# EAGLE design OBC_v4.22 (EAGLE 9.6.2)

## Sheet 1 of 3
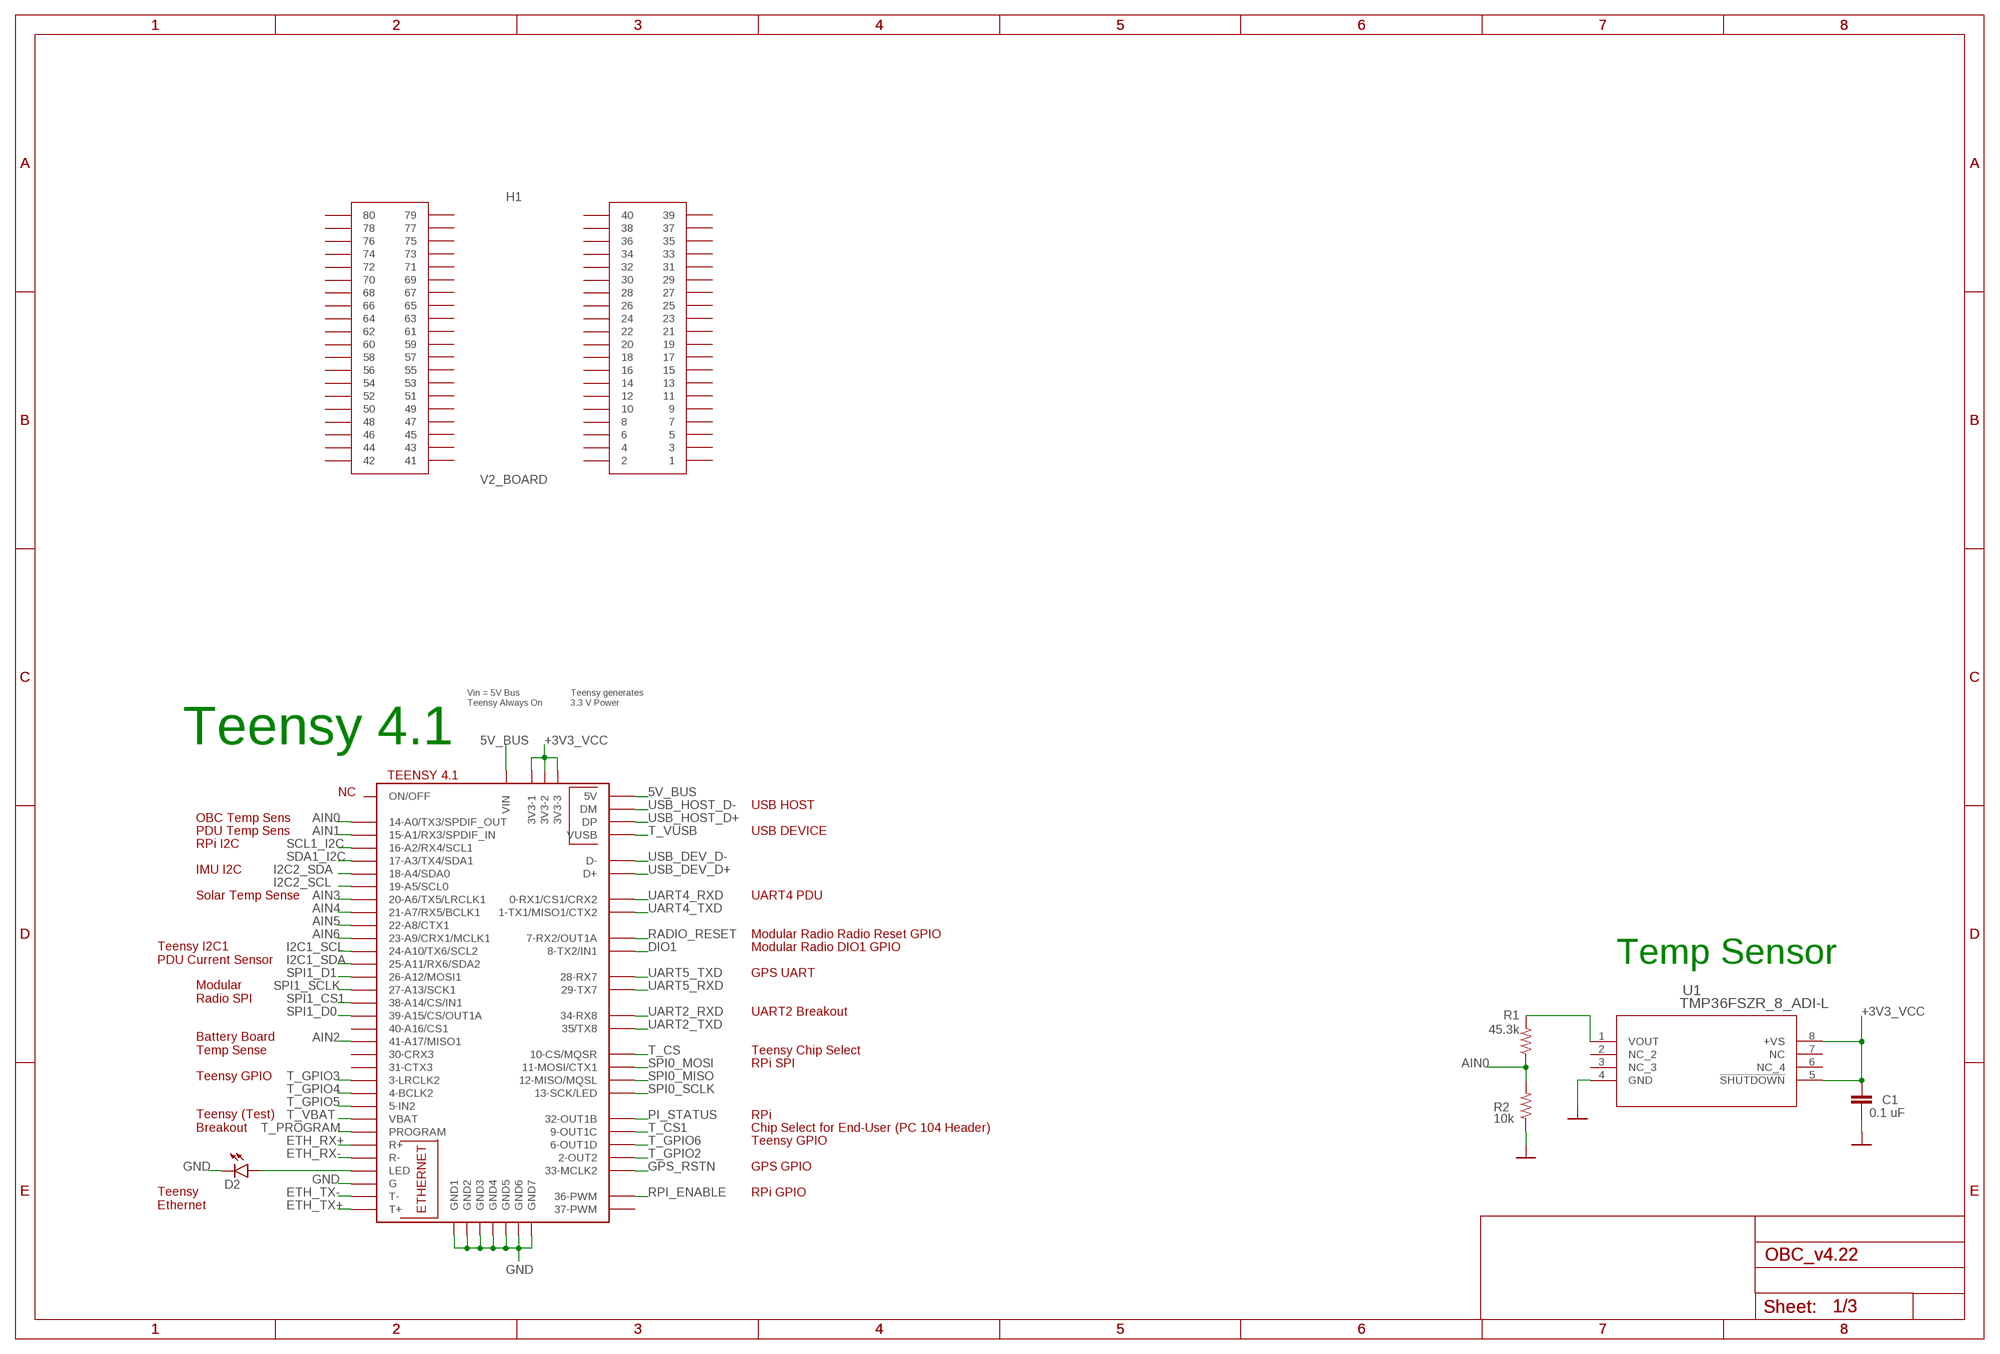
[diagram p0: schematic, sheet 1]

### Parts
C1  0.1 uF  CAP0805  [0805]
D2  LEDCHIP-LED0603  [CHIP-LED0603]
H1  V2_BOARD  [BOARD_TEMPLATE]
R1  45.3k  RESISTOR0805-RES  [0805]
R2  10k  RESISTOR0805-RES  [0805]
U1  TMP36FSZR_8_ADI-L  [R_8_ADI-L]
U$1  TEENSY41TEENSY  [TEENSY41]

### Nets
5V_BUS: U$1.+5V(5V) U$1.VIN ; also sheet 2
+3V3_VCC: C1.1 U1.5(!SHUTDOWN) U1.8(+VS) U$1.3V3-1 U$1.3V3-2 U$1.3V3-3 ; also sheet 3
AIN0: R1.1 R2.2 U$1.14-A0/TX3/SPDIF_OUT
AIN1: U$1.15-A1/RX3/SPDIF_IN
AIN2: U$1.41-A17/MISO1
AIN3: U$1.20-A6/TX5/LRCLK1
AIN4: U$1.21-A7/RX5/BCLK1
AIN5: U$1.22-A8/CTX1
AIN6: U$1.23-A9/CRX1/MCLK1
DIO1: U$1.8-TX2/IN1 ; also sheet 3
ETH_RX+: U$1.R+
ETH_RX-: U$1.R-
ETH_TX+: U$1.T+
ETH_TX-: U$1.T-
GND: C1.2 D2.C R2.1 U1.4(GND) U$1.G U$1.GND1 U$1.GND2 U$1.GND3 U$1.GND4 U$1.GND5 U$1.GND6 U$1.GND(GND7) ; also sheet 2,3
GPS_RSTN: U$1.33-MCLK2 ; also sheet 3
I2C1_SCL: U$1.24-A10/TX6/SCL2
I2C1_SDA: U$1.25-A11/RX6/SDA2
I2C2_SCL: U$1.19-A5/SCL0 ; also sheet 3
I2C2_SDA: U$1.18-A4/SDA0 ; also sheet 3
N$8: D2.A U$1.LED
N$15: R1.2 U1.1(VOUT)
PI_STATUS: U$1.32-OUT1B ; also sheet 2
RADIO_RESET: U$1.7-RX2/OUT1A ; also sheet 3
RPI_ENABLE: U$1.36-PWM ; also sheet 2
SCL1_I2C: U$1.16-A2/RX4/SCL1 ; also sheet 2
SDA1_I2C: U$1.17-A3/TX4/SDA1 ; also sheet 2
SPI0_MISO: U$1.12-MISO/MQSL ; also sheet 2
SPI0_MOSI: U$1.11-MOSI/CTX1 ; also sheet 2
SPI0_SCLK: U$1.13-SCK/LED ; also sheet 2
SPI1_CS1: U$1.38-A14/CS/IN1 ; also sheet 3
SPI1_D0: U$1.39-A15/CS/OUT1A ; also sheet 3
SPI1_D1: U$1.26-A12/MOSI1 ; also sheet 3
SPI1_SCLK: U$1.27-A13/SCK1 ; also sheet 3
T_CS: U$1.10-CS\MQSR(10-CS/MQSR)
T_CS1: U$1.9-OUT1C
T_GPIO2: U$1.2-OUT2
T_GPIO3: U$1.3-LRCLK2
T_GPIO4: U$1.4-BCLK2
T_GPIO5: U$1.5-IN2
T_GPIO6: U$1.6-OUT1D
T_PROGRAM: U$1.PROGRAM
T_VBAT: U$1.VBAT
T_VUSB: U$1.VUSB
UART2_RXD: U$1.34-RX8
UART2_TXD: U$1.35-TX8(35/TX8)
UART4_RXD: U$1.0-RX1/CS1/CRX2
UART4_TXD: U$1.1-TX1/MISO1/CTX2
UART5_RXD: U$1.29-TX7 ; also sheet 3
UART5_TXD: U$1.28-RX7 ; also sheet 3
USB_DEV_D+: U$1.D+
USB_DEV_D-: U$1.D-
USB_HOST_D+: U$1.DP
USB_HOST_D-: U$1.DM
Unconnected: H1.1 H1.2 H1.3 H1.4 H1.5 H1.6 H1.7 H1.8 H1.9 H1.10 H1.11 H1.12 H1.13 H1.14 H1.15 H1.16 H1.17 H1.18 H1.19 H1.20 H1.21 H1.22 H1.23 H1.24 H1.25 H1.26 H1.27 H1.28 H1.29 H1.30 H1.31 H1.32 H1.33 H1.34 H1.35 H1.36 H1.37 H1.38 H1.39 H1.40 H1.41 H1.42 H1.43 H1.44 H1.45 H1.46 H1.47 H1.48 H1.49 H1.50 H1.51 H1.52 H1.53 H1.54 H1.55 H1.56 H1.57 H1.58 H1.59 H1.60 H1.61 H1.62 H1.63 H1.64 H1.65 H1.66 H1.67 H1.68 H1.69 H1.70 H1.71 H1.72 H1.73 H1.74 H1.75 H1.76 H1.77 H1.78 H1.79 H1.80 U1.2(NC_2) U1.3(NC_3) U1.6(NC_4) U1.7(NC) U$1.30-CRX3 U$1.31-CTX3 U$1.37-PWM U$1.40-A16/CS1 U$1.ON/OFF

### Notes on the sheet
- Vin = 5V Bus 
  Teensy Always On
- Teensy generates 
  3.3 V Power
- Teensy 4.1
- NC
- USB HOST
- OBC Temp Sens
- PDU Temp Sens | USB DEVICE
- RPi I2C
- IMU I2C
- Solar Temp Sense | UART4 PDU
- Modular Radio Radio Reset GPIO
- Modular Radio DIO1 GPIO
- Teensy I2C1
  PDU Current Sensor
- Temp Sensor
- GPS UART
- Modular 
  Radio SPI
- UART2 Breakout
- Battery Board
  Temp Sense
- Teensy Chip Select
- RPi SPI
- Teensy GPIO
- RPi
- Teensy (Test)
  Breakout
- Chip Select for End-User (PC 104 Header)
- Teensy GPIO
- GPS GPIO
- RPi GPIO
- Teensy 
  Ethernet

## Sheet 2 of 3
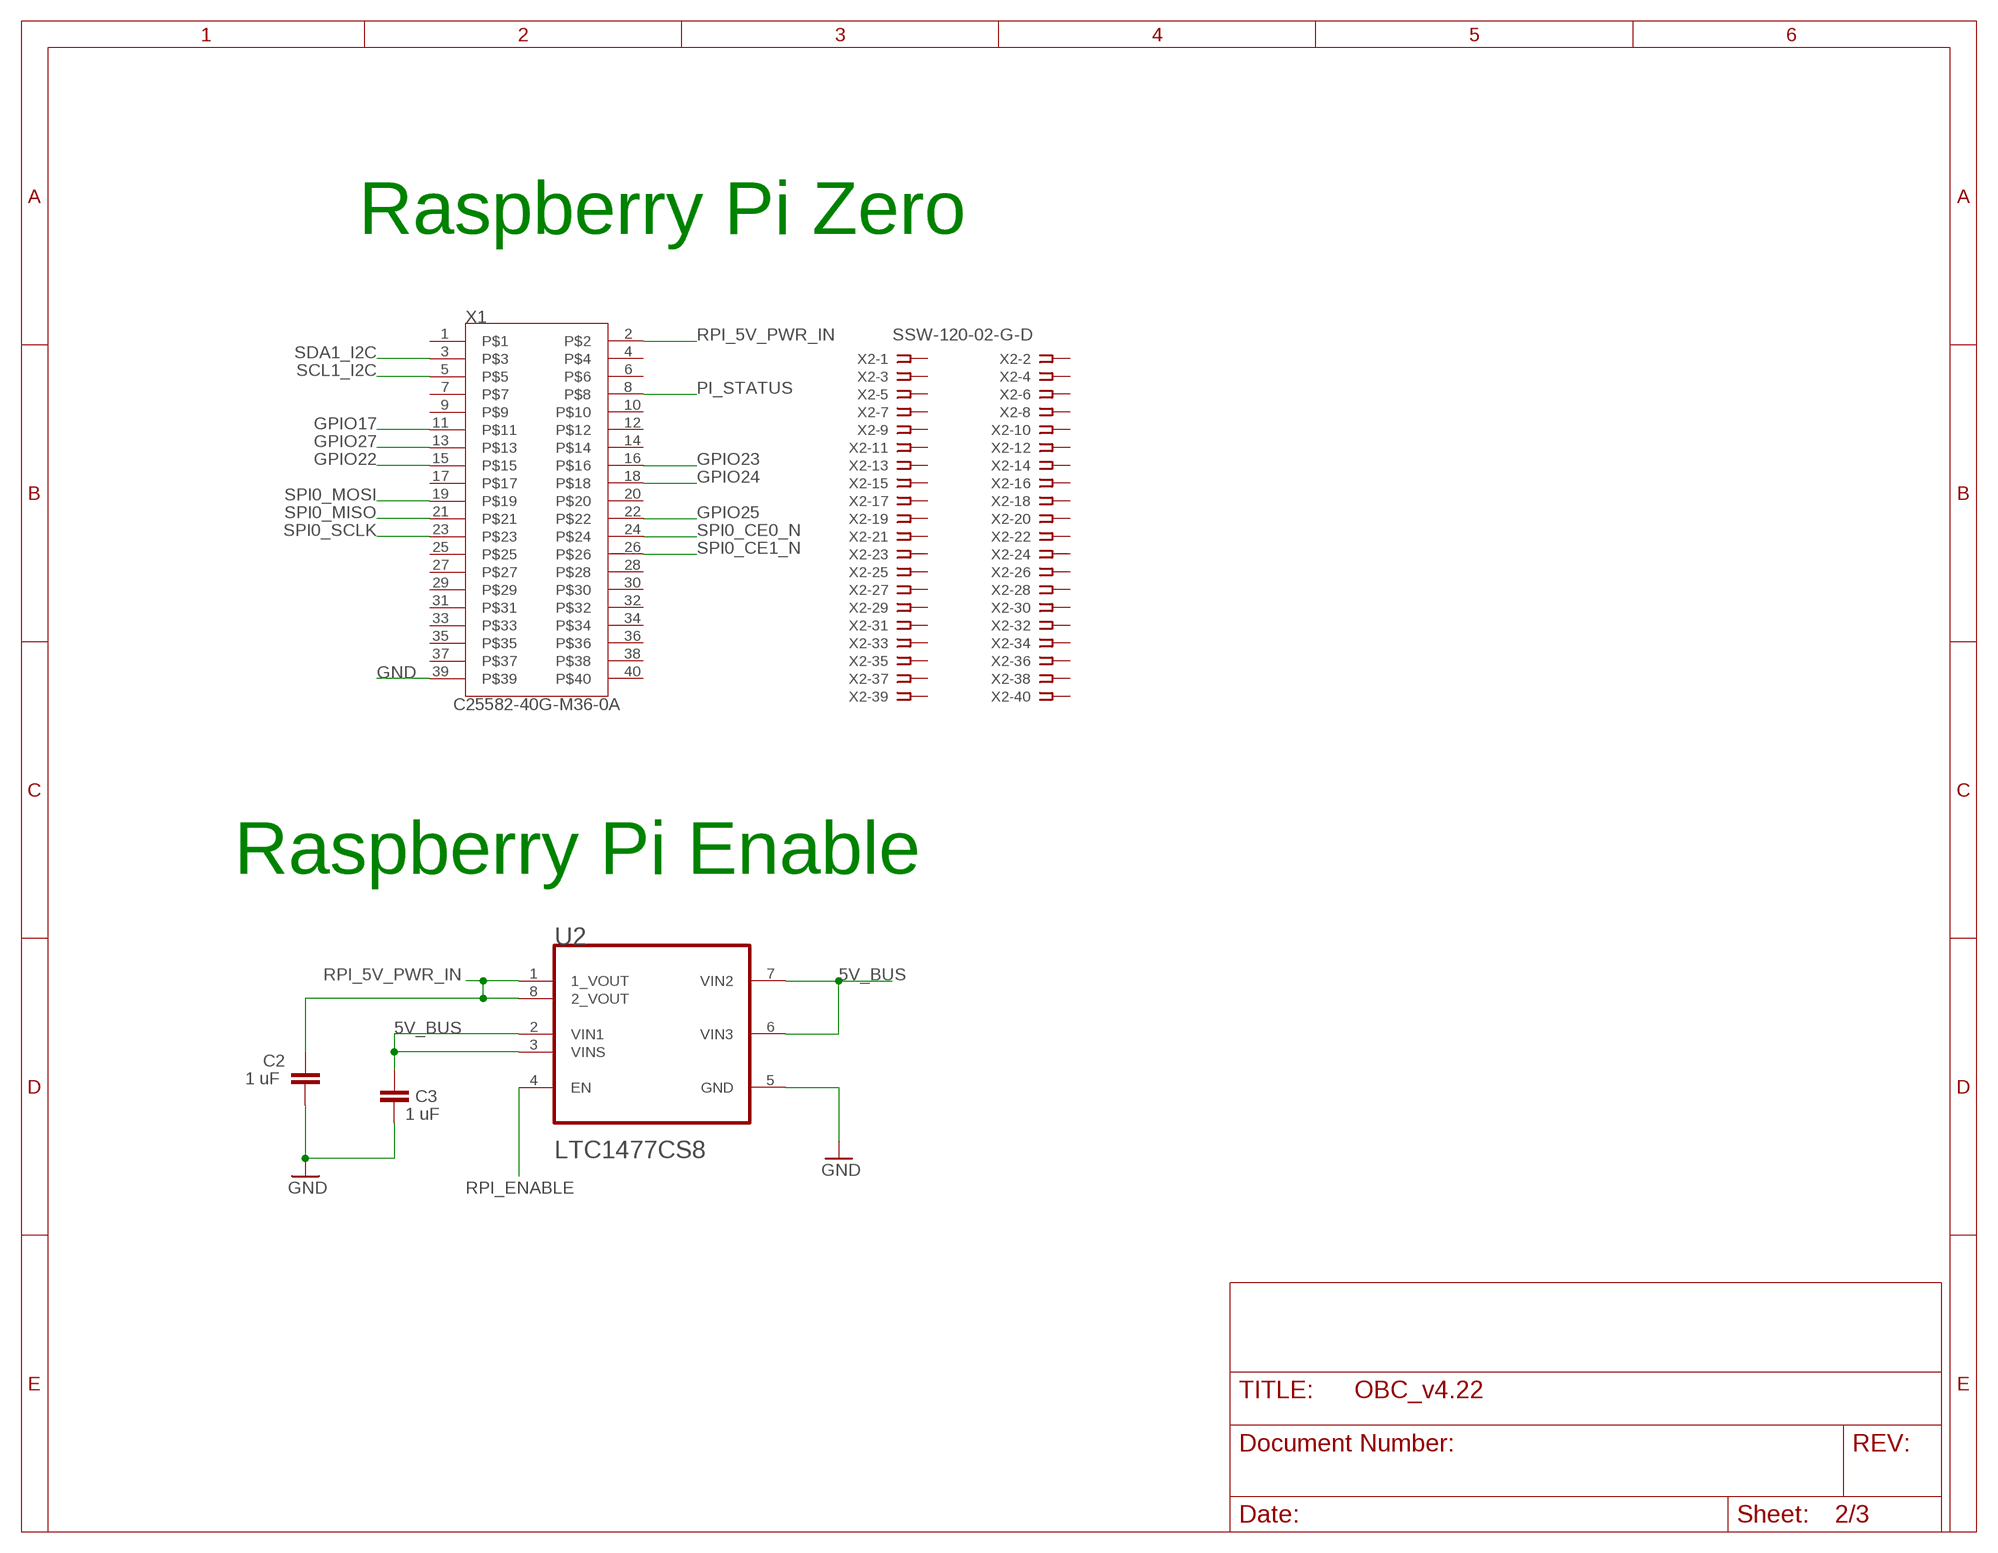
[diagram p1: schematic, sheet 2]

### Parts
C2  1 uF  CAP0805  [0805]
C3  1 uF  CAP0805  [0805]
U2  LTC1477CS8LINEAR_TECHNOLOGY_LTC1477CS8_0_2  [LINEAR_TECHNOLOGY_LTC1477CS8_2]
X1  C25582-40G-M36-0A  [ADAFRUIT_C25582-40G-M36-0A_0]
X2  SSW-120-02-G-D  [SSW-120-02-G-D]

### Nets
5V_BUS: C3.1 U2.2(VIN1) U2.3(VINS) U2.6(VIN3) U2.7(VIN2) ; also sheet 1
GND: C2.2 C3.2 U2.5(GND) X1.39 ; also sheet 1,3
GPIO17: X1.11
GPIO22: X1.15
GPIO23: X1.16
GPIO24: X1.18
GPIO25: X1.22
GPIO27: X1.13
PI_STATUS: X1.8 ; also sheet 1
RPI_5V_PWR_IN: C2.1 U2.1(1_VOUT) U2.8(2_VOUT) X1.2
RPI_ENABLE: U2.4(EN) ; also sheet 1
SCL1_I2C: X1.5 ; also sheet 1
SDA1_I2C: X1.3 ; also sheet 1
SPI0_CE0_N: X1.24
SPI0_CE1_N: X1.26
SPI0_MISO: X1.21 ; also sheet 1
SPI0_MOSI: X1.19 ; also sheet 1
SPI0_SCLK: X1.23 ; also sheet 1
Unconnected: X1.1 X1.4 X1.6 X1.7 X1.9 X1.10 X1.12 X1.14 X1.17 X1.20 X1.25 X1.27 X1.28 X1.29 X1.30 X1.31 X1.32 X1.33 X1.34 X1.35 X1.36 X1.37 X1.38 X1.40 X2.1 X2.2 X2.3 X2.4 X2.5 X2.6 X2.7 X2.8 X2.9 X2.10 X2.11 X2.12 X2.13 X2.14 X2.15 X2.16 X2.17 X2.18 X2.19 X2.20 X2.21 X2.22 X2.23 X2.24 X2.25 X2.26 X2.27 X2.28 X2.29 X2.30 X2.31 X2.32 X2.33 X2.34 X2.35 X2.36 X2.37 X2.38 X2.39 X2.40

### Notes on the sheet
- Raspberry Pi Zero
- Raspberry Pi Enable

## Sheet 3 of 3
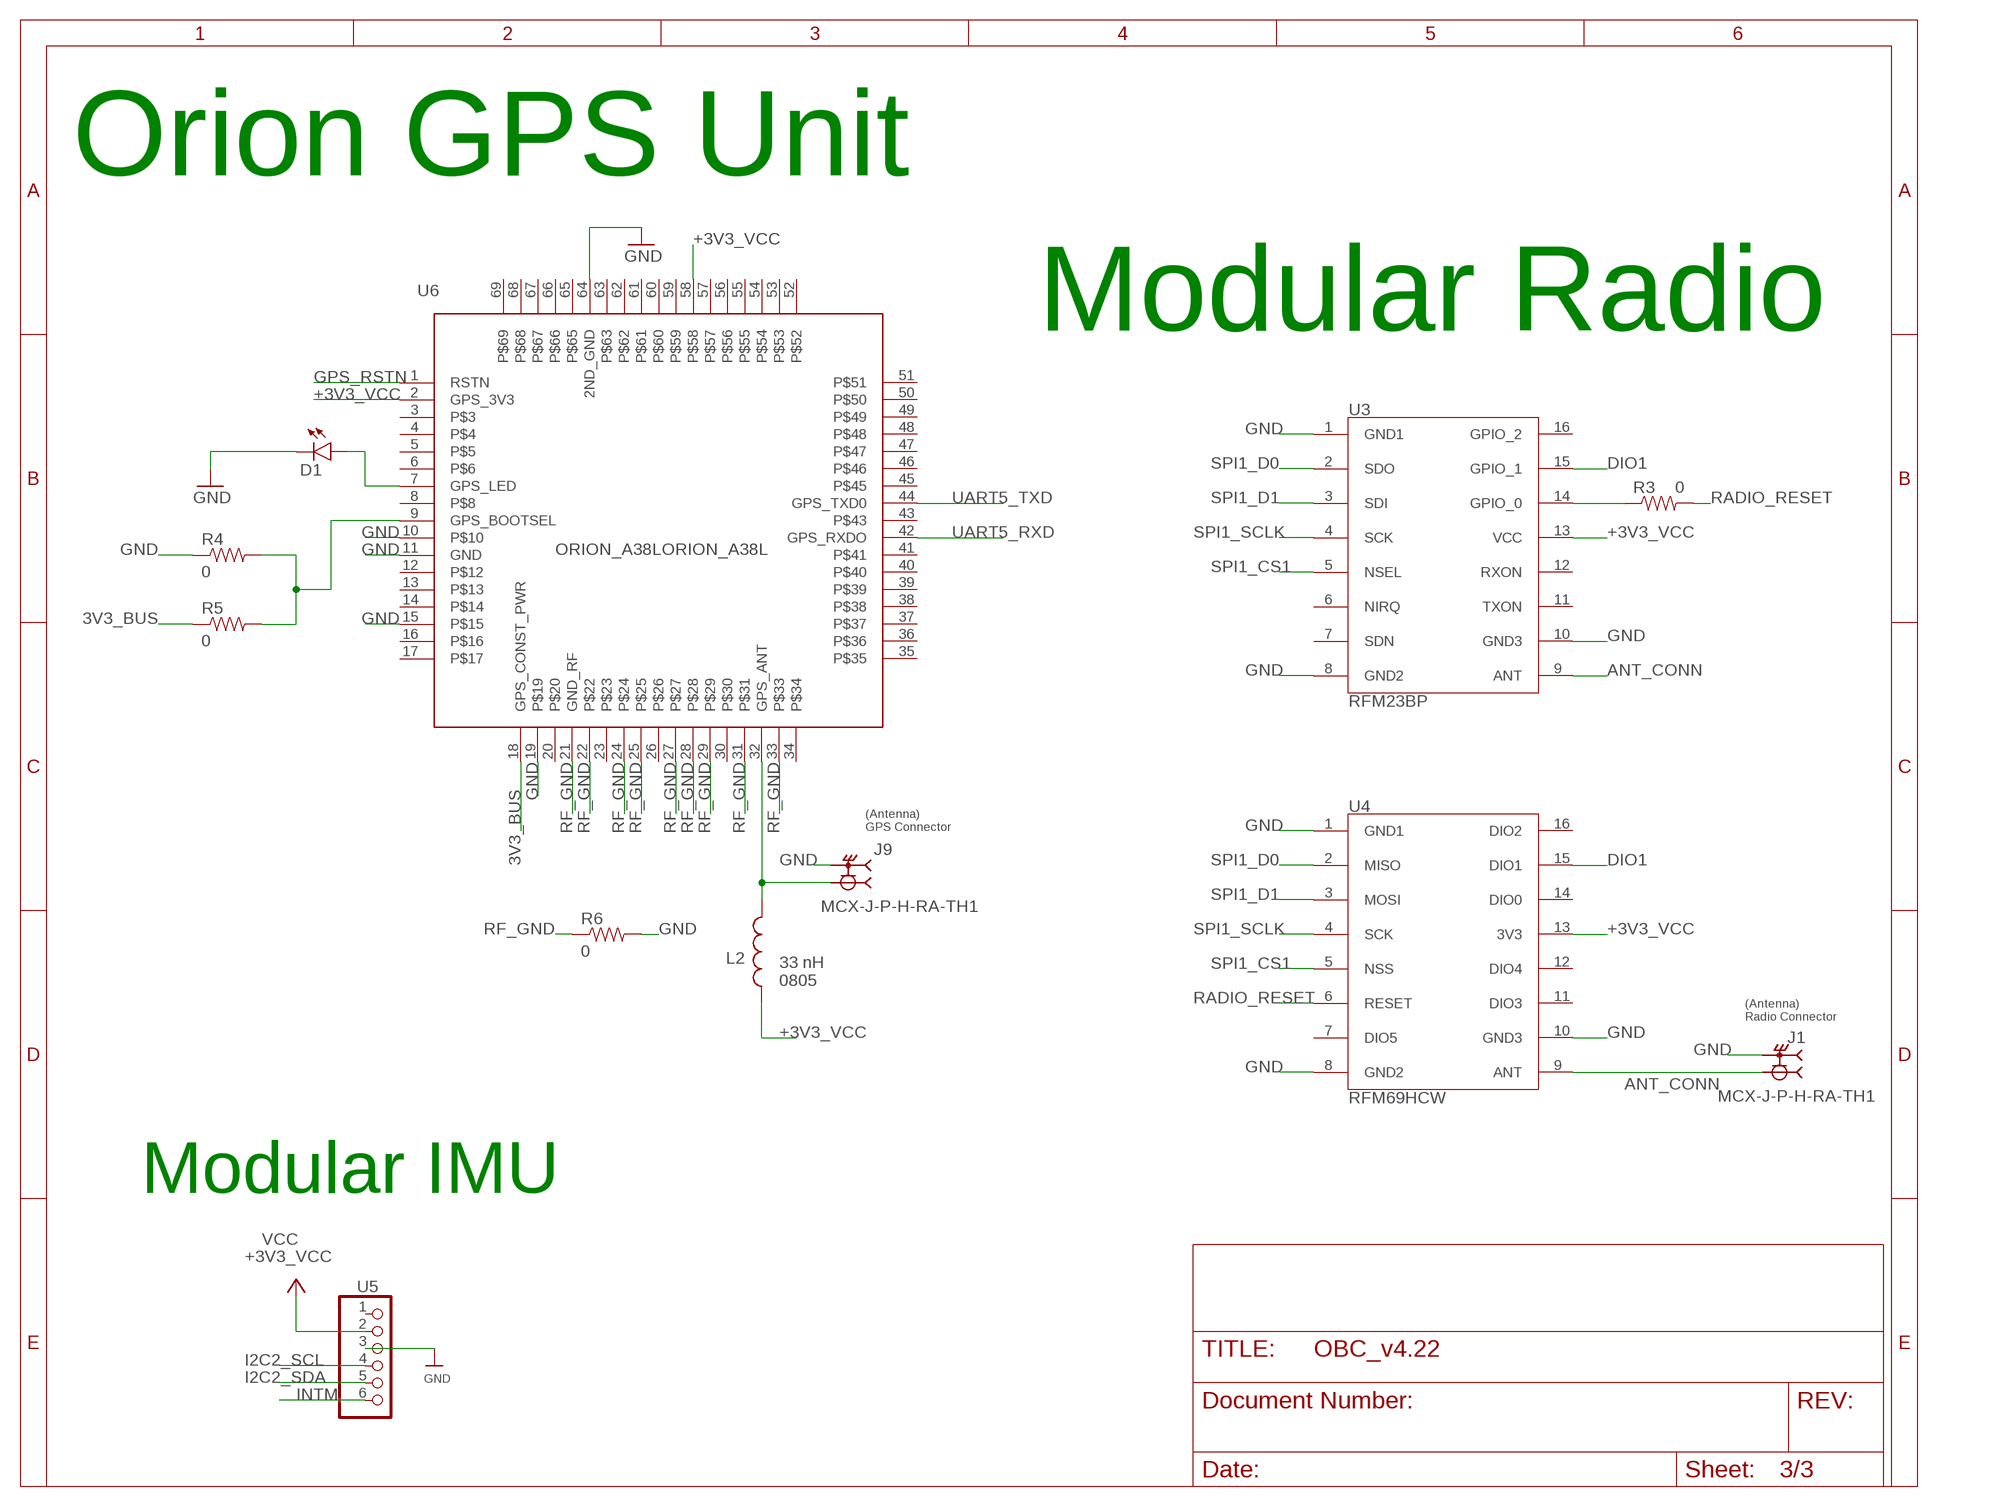
[diagram p2: schematic, sheet 3]

### Parts
D1  LEDCHIP-LED0603  [CHIP-LED0603]
J1  MCX-J-P-H-RA-TH1  [SAMTEC_MCX-J-P-H-RA-TH1]
J9  MCX-J-P-H-RA-TH1  [SAMTEC_MCX-J-P-H-RA-TH1]
L2  AIMC-0805-2N2S-T  [INDC2012X105N]
R3  0  RESISTOR0805-RES  [0805]
R4  0  RESISTOR0805-RES  [0805]
R5  0  RESISTOR0805-RES  [0805]
R6  0  RESISTOR0805-RES  [0805]
U3  RFM23BP  [RFM23BP]
U4  RFM69HCW  [RFM69HCW]
U5  HEADER-1X670MIL  [1X06_ROUND_70]
U6  ORION_A38LORION_A38L  [ORION_A38L]

### Nets
3V3_BUS: R5.1 U6.18(GPS_CONST_PWR)
+3V3_VCC: L2.1 U3.13(VCC) U4.13(3V3) U5.2 U6.2(GPS_3V3) U6.58 ; supply symbol labelled VCC ; also sheet 1
ANT_CONN: J1.1 U3.9(ANT) U4.9(ANT)
DIO1: U3.15(GPIO_1) U4.15(DIO1) ; also sheet 1
GND: D1.C J1.S1 J1.S2 J1.S3 J1.S4 J9.S1 J9.S2 J9.S3 J9.S4 R4.1 R6.2 U3.1(GND1) U3.8(GND2) U3.10(GND3) U4.1(GND1) U4.8(GND2) U4.10(GND3) U5.3 U6.10 U6.11(GND) U6.15 U6.19 U6.64(2ND_GND) ; also sheet 1,2
GPS_RSTN: U6.1(RSTN) ; also sheet 1
I2C2_SCL: U5.4 ; also sheet 1
I2C2_SDA: U5.5 ; also sheet 1
INTM: U5.6
N$9: R3.1 U3.14(GPIO_0)
N$16: R4.2 R5.2 U6.9(GPS_BOOTSEL)
N$17: J9.1 L2.2 U6.32(GPS_ANT)
N$21: D1.A U6.7(GPS_LED)
RADIO_RESET: R3.2 U4.6(RESET) ; also sheet 1
RF_GND: R6.1 U6.21(GND_RF) U6.22 U6.24 U6.25 U6.27 U6.28 U6.29 U6.31 U6.33
SPI1_CS1: U3.5(NSEL) U4.5(NSS) ; also sheet 1
SPI1_D0: U3.2(SDO) U4.2(MISO) ; also sheet 1
SPI1_D1: U3.3(SDI) U4.3(MOSI) ; also sheet 1
SPI1_SCLK: U3.4(SCK) U4.4(SCK) ; also sheet 1
UART5_RXD: U6.42(GPS_RXDO) ; also sheet 1
UART5_TXD: U6.44(GPS_TXD0) ; also sheet 1
Unconnected: U3.6(NIRQ) U3.7(SDN) U3.11(TXON) U3.12(RXON) U3.16(GPIO_2) U4.7(DIO5) U4.11(DIO3) U4.12(DIO4) U4.14(DIO0) U4.16(DIO2) U5.1 U6.3 U6.4 U6.5 U6.6 U6.8 U6.12 U6.13 U6.14 U6.16 U6.17 U6.20 U6.23 U6.26 U6.30 U6.34 U6.35 U6.36 U6.37 U6.38 U6.39 U6.40 U6.41 U6.43 U6.45 U6.46 U6.47 U6.48 U6.49 U6.50 U6.51 U6.52 U6.53 U6.54 U6.55 U6.56 U6.57 U6.59 U6.60 U6.61 U6.62 U6.63 U6.65 U6.66 U6.67 U6.68 U6.69

### Notes on the sheet
- Orion GPS Unit
- Modular Radio
- (Antenna)
  GPS Connector
- 33 nH
  0805
- (Antenna)
  Radio Connector
- Modular IMU

## Library data of the parts
C1-C3 = HSFL_Main_Library:CAP: Capacitor Standard 0603 ceramic capacitor, and 0.1" leaded capacitor.
D1 D2 = led:LED: LED OSRAM: - CHIPLED LG R971, LG N971, LY N971, LG Q971, LY Q971, LO R971, LY R971 LH N974, LH R974 LS Q976, LO Q976, LY Q976 LO Q996 - Hyper CHIPLED LW Q18S LB Q993, LB Q99A, LB R99A - SideLED LS A670, LO A670, LY A670, LG A670, LP A670 LB A673, LV A673, LT A673, LW A673 LH A674 LY A675 LS A676, LA A676, LO A676, LY A676, LW A676 LS A679, LY A679, LG A679 - Hyper Micro SIDELED® LS Y876, LA Y876, LO Y876, LY Y876 LT Y87S - SmartLED LW L88C, LW L88S LB L89C, LB L89S, LG L890 LS L89K, LO L89K, LY L89K LS L896, LA L896, LO L896, LY L896 - TOPLED LS T670, LO T670, LY T670, LG T670, LP T670 LSG T670, LSP T670, LSY T670, LOP T670, LYG T670 LG T671, LOG T671, LSG T671 LB T673, LV T673, LT T673, LW T673 LH T674 LS T676, LA T676, LO T676, LY T676, LB T676, LH T676, LSB T676, LW T676 LB T67C, LV T67C, LT T67C, LS T67K, LO T67K, LY T67K, LW E67C LS E67B, LA E67B, LO E67B, LY E67B, LB E67C, LV E67C, LT E67C LW T67C LS T679, LY T679, LG T679 LS T770, LO T770, LY T770, LG T770, LP T770 LB T773, LV T773, LT T773, LW T773 LH T774 LS E675, LA E675, LY E675, LS T675 LS T776, LA T776, LO T776, LY T776, LB T776 LHGB T686 LT T68C, LB T68C - Hyper Mini TOPLED® LB M676 - Mini TOPLED Santana® LG M470 LS M47K, LO M47K, LY M47K Source: http://www.osram.convergy.de LUXEON: - LUMILED® LXK2-PW12-R00, LXK2-PW12-S00, LXK2-PW14-U00, LXK2-PW14-V00 LXK2-PM12-R00, LXK2-PM12-S00, LXK2-PM14-U00 LXK2-PE12-Q00, LXK2-PE12-R00, LXK2-PE12-S00, LXK2-PE14-T00, LXK2-PE14-U00 LXK2-PB12-K00, LXK2-PB12-L00, LXK2-PB12-M00, LXK2-PB14-N00, LXK2-PB14-P00, LXK2-PB14-Q00 LXK2-PR12-L00, LXK2-PR12-M00, LXK2-PR14-Q00, LXK2-PR14-R00 LXK2-PD12-Q00, LXK2-PD12-R00, LXK2-PD12-S00 LXK2-PH12-R00, LXK2-PH12-S00 LXK2-PL12-P00, LXK2-PL12-Q00, LXK2-PL12-R00 Source: www.luxeon.com KINGBRIGHT: KA-3528ASYC Source: www.kingbright.com
H1 = Artemis v2 board:V2_BOARD
J1 J9 = OBCv4:MCX-J-P-H-RA-TH1: 50 Ohm MCX Jack or Plug, Through-hole; DESCRIPTION: MCX Connector Jack, Female Socket 50Ohm Through Hole, Right Angle Solder; DIGI-KEY_PART_NUMBER: SAM10607-ND; MF: Samtec; MP: MCX-J-P-H-RA-TH1; PACKAGE: None; PURCHASE-URL: https://pricing.snapeda.com/search/part/MCX-J-P-H-RA-TH1/?ref=eda
L2 = PDU:AIMC-0805-2N2S-T: 2.2nH Unshielded Multilayer Inductor 600mA 100mOhm Max 0805 (2012 Metric); DESCRIPTION: IND 2.2nH 0.3A 100mΩ; DIGI-KEY_PART_NUMBER: 535-11562-1-ND; MF: Abracon; MP: AIMC-0805-2N2S-T; PACKAGE: 2012 Bourns
R1-R6 = HSFL_Main_Library:RESISTOR: Resistor Basic schematic elements and footprints for 0603, 1206, and PTH resistors.
U1 = TMP36FSZR_8:TMP36FSZ; COPYRIGHT: Copyright (C) 2021 Ultra Librarian. All rights reserved.; MANUFACTURER_PART_NUMBER: TMP36FSZ; MFR_NAME: Analog Devices Inc
U2 = Artemis:LTC1477CS8: LT-LTC1477-S8-8; CIIVA_IDS: 1432281; COMPONENT_LINK_1_DESCRIPTION: Manufacturer URL; COMPONENT_LINK_1_URL: http://www.linear.com/; COMPONENT_LINK_3_DESCRIPTION: Package Specification; COMPONENT_LINK_3_URL: http://cds.linear.com/docs/en/packaging/05081610_G_SO8.pdf; DATASHEET: http://cds.linear.com/docs/en/datasheet/lt1477.pdf; FOOTPRINT_VARIANT_NAME_0: Level C; FOOTPRINT_VARIANT_NAME_1: Level B; FOOTPRINT_VARIANT_NAME_2: Level A; IMPORTED: yes; IMPORTED_FROM: vault; IMPORT_TS: 1521843574; MF: Linear Technology; MOUNTING_TECHNOLOGY: Surface Mount; MPN: LTC1477CS8; PACKAGE: S8-8; PACKAGE_DESCRIPTION: 8-Pin Plastic Small Outline (Narrow .150 Inch), Body 4.9 x 3.9 mm, Pitch 1.27 mm; PACKAGE_VERSION: Rev. G, 03/2012; PREFIX: U; RELEASE_DATE: 1377817843; ROHS: No; VAULT_GUID: 635B2D7C-EC07-409E-A57F-666E02CD64AC; VAULT_REVISION: 6B8B57C2-2CB3-4970-A31A-1EB58B636423
U3 = RFM RADIOS:RFM23BP
U4 = RFM RADIOS:RFM69HCW
U5 = microbuilder:HEADER-1X6: PIN HEADER
U6 = Artemis:ORION_A38L
U$1 = OBCv4:TEENSY41
X1 = Adafruit - C25582-40G-M36-0A:C25582-40G-M36-0A
X2 = con-samtec-edited:SSW-120-02-G: THROUGH-HOLE .025" SQ POST SOCKET Source: Samtec SSW.pdf; MF: Samtec Inc.; MPN: SSW-120-02-G-D; OC_FARNELL: unknown; OC_NEWARK: 11P9639

## Net classes
1 highpower: width 0.406 mm, drill 0.483 mm
2 lowpower: width 0.305 mm, drill 0.483 mm

## Board
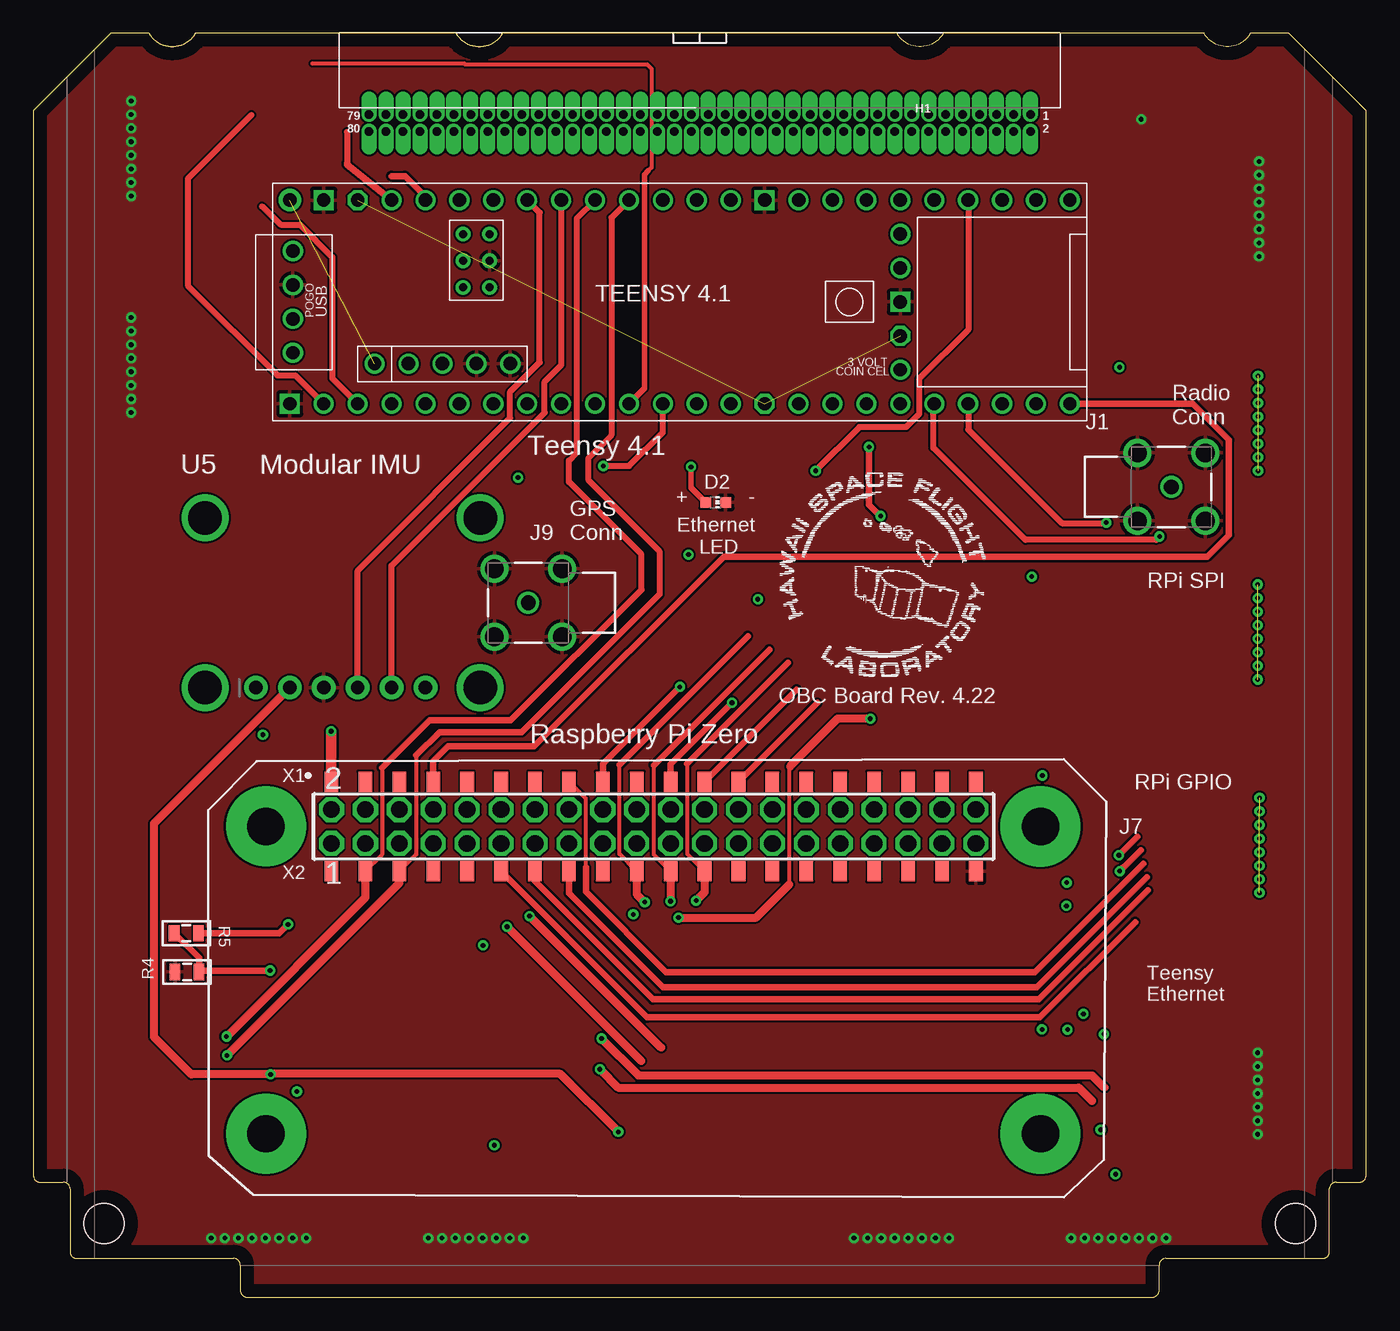
[diagram p3: board, top side]
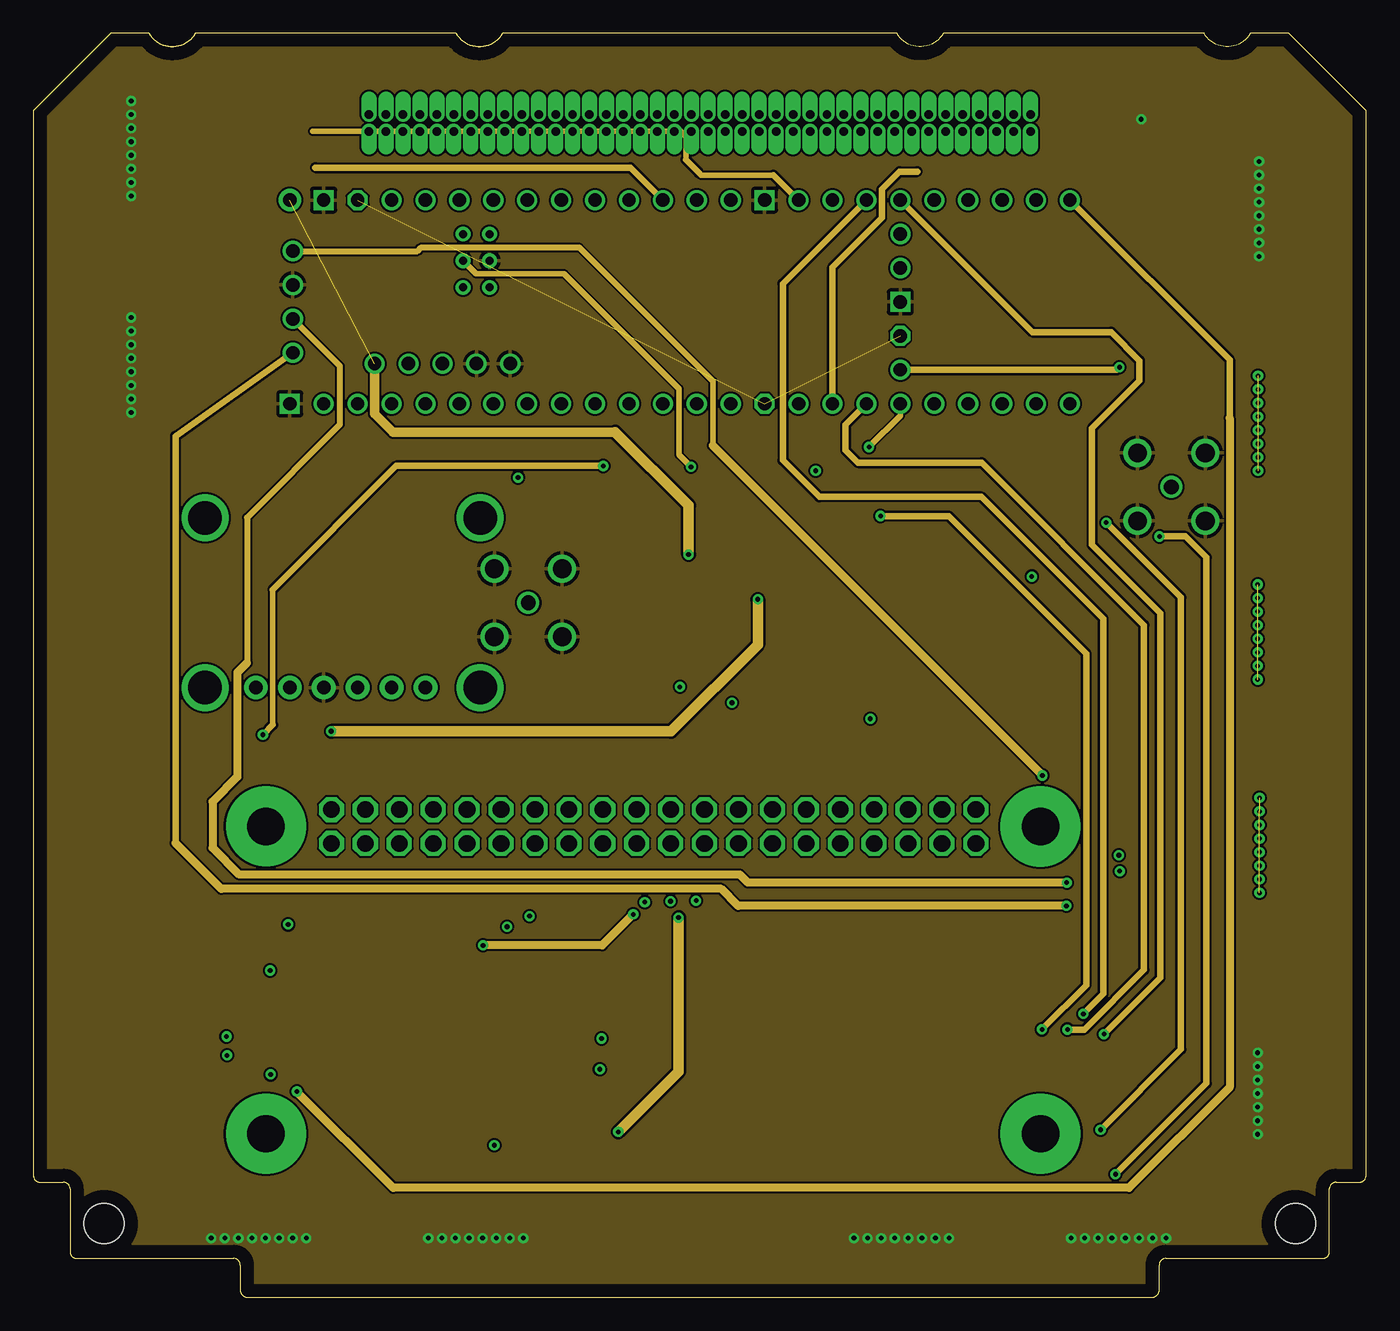
[diagram p4: board, inner layer Route2]
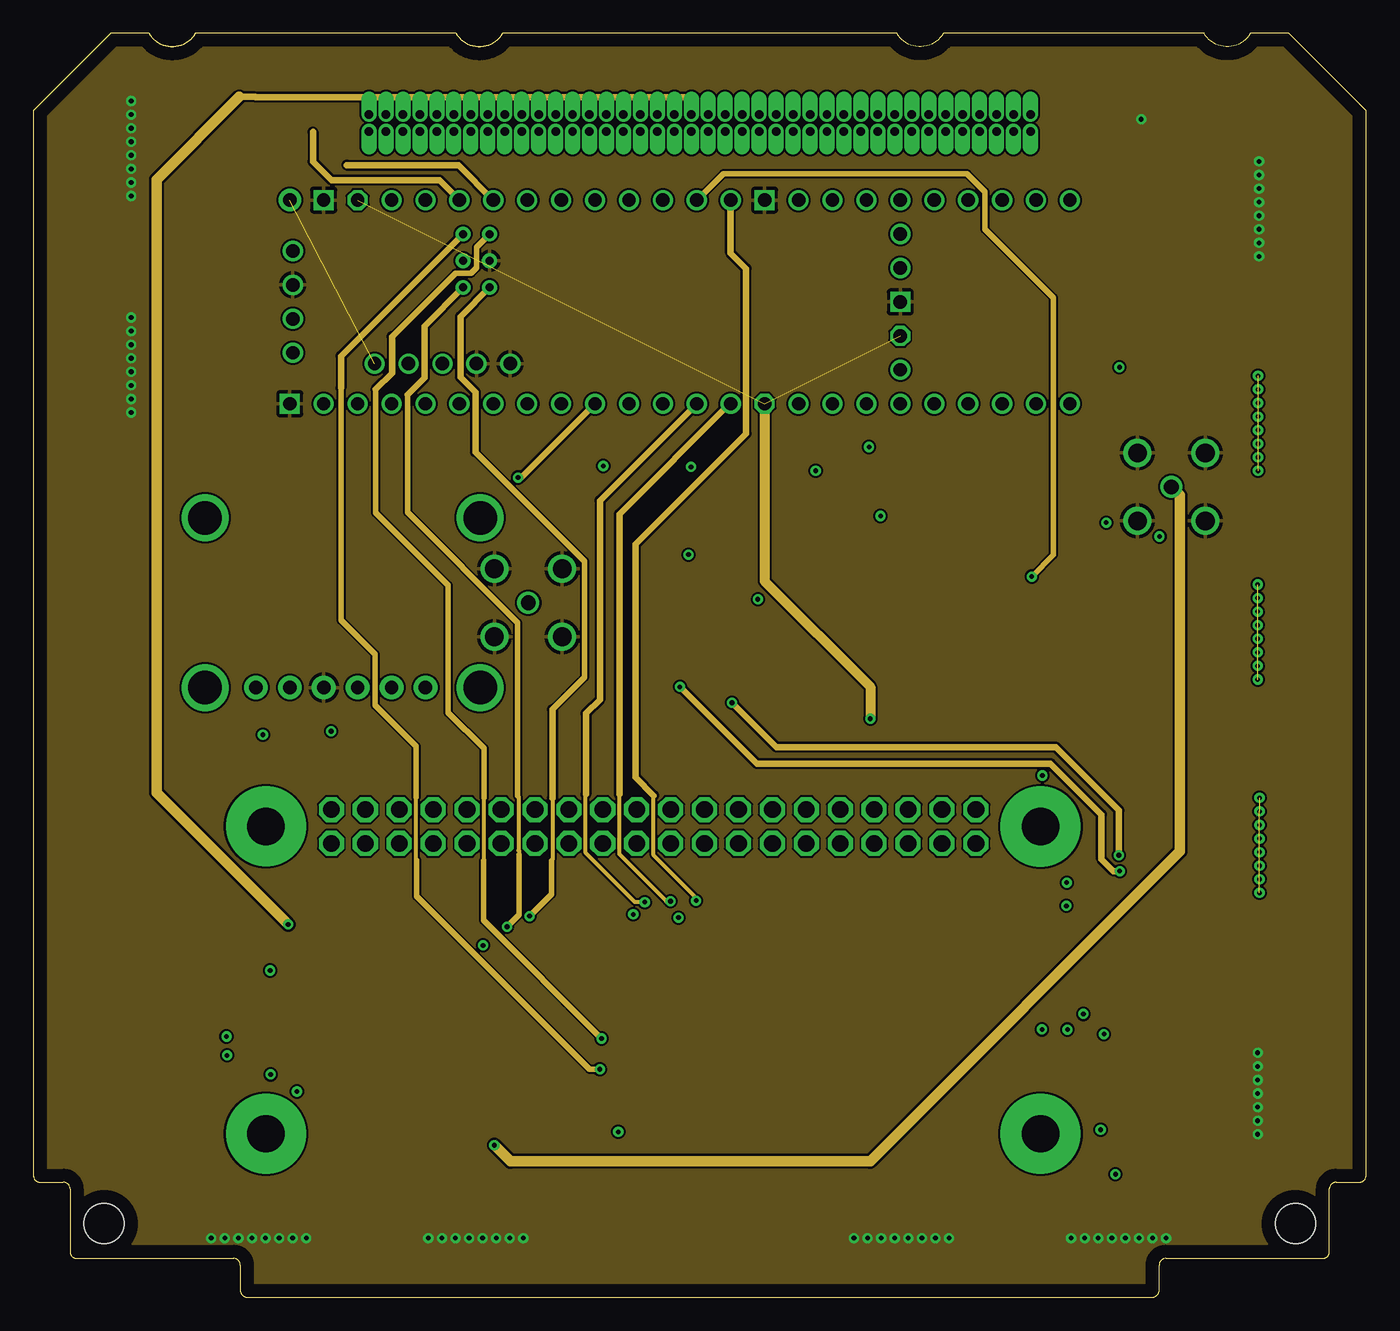
[diagram p5: board, inner layer Route15]
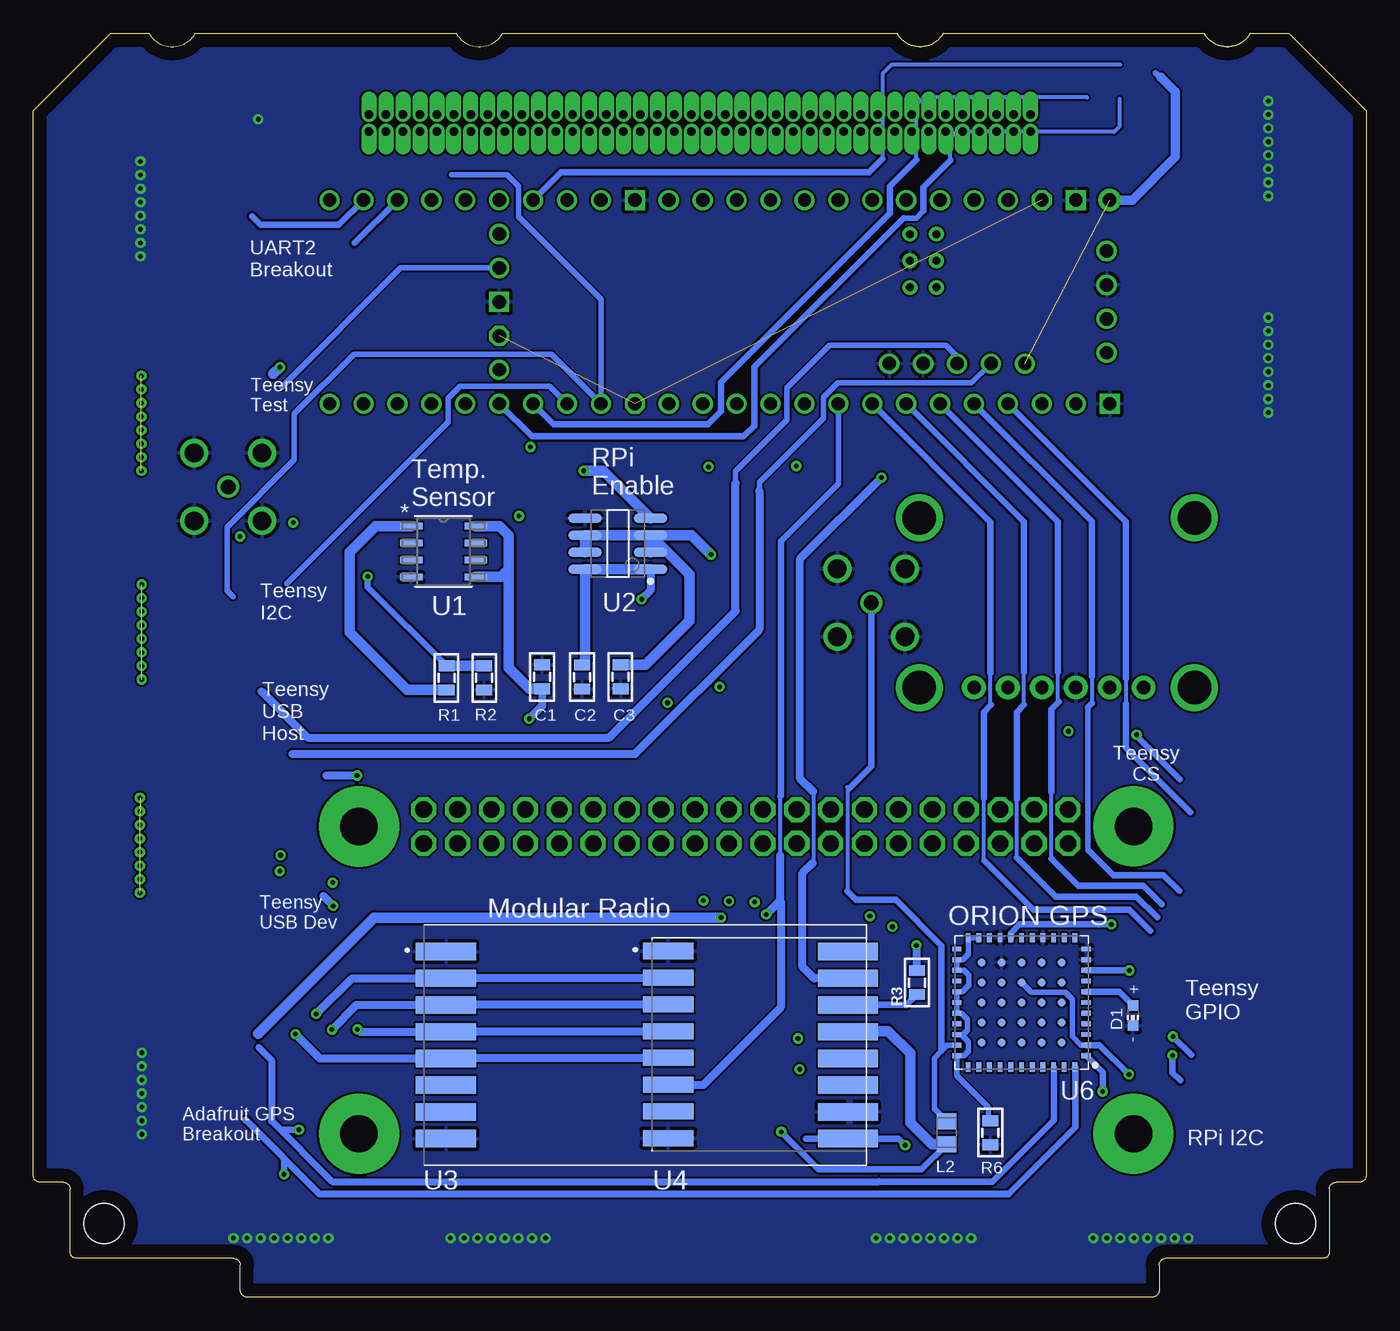
[diagram p6: board, bottom side, seen from below]

Size 99.8 x 94.6 mm. Coordinates in mm from the lower left corner, seen from the top.
Copper layers (1+2*15+16): Top 0.035mm / dielectric 1.5mm / Route2 0.035mm / dielectric 0.15mm / Route15 0.035mm / dielectric 0.2mm / Bottom 0.035mm
Design rules "default *": minimum track width 6mil, minimum drill 8mil, track to track 6mil, track to pad 6mil, pad to pad 6mil, via to via 6mil, smd to smd 6mil, copper to edge 40mil, drill to drill 6mil, minimum pad ring 10mil, minimum via ring 8mil, stop-mask expansion 4mil, vias tented up to drill 0mil, thermal gap 10mil

### Footprints (pad centres in the part's own frame; a part is rotated, then mirrored left to right if it is on the bottom)
0805 = smd 0.8 x 1.2: 1 -0.9,0; 2 0.9,0
CHIP-LED0603 = smd 0.8 x 0.8: A 0,-0.75; C 0,0.75
BOARD_TEMPLATE = drill 0.635 pad 0.965 offset: 1 74.665,88.535; 2 74.665,87.265; 3 73.395,88.535; 4 73.395,87.265; 5 72.125,88.535; 6 72.125,87.265; 7 70.855,88.535; 8 70.855,87.265; 9 69.585,88.535; 10 69.585,87.265; 11 68.315,88.535; 12 68.315,87.265; 13 67.045,88.535; 14 67.045,87.265; 15 65.775,88.535; 16 65.775,87.265; 17 64.505,88.535; 18 64.505,87.265; 19 63.235,88.535; 20 63.235,87.265; 21 61.965,88.535; 22 61.965,87.265; 23 60.695,88.535; 24 60.695,87.265; 25 59.425,88.535; 26 59.425,87.265; 27 58.155,88.535; 28 58.155,87.265; 29 56.885,88.535; 30 56.885,87.265; 31 55.615,88.535; 32 55.615,87.265; 33 54.345,88.535; 34 54.345,87.265; 35 53.075,88.535; 36 53.075,87.265; 37 51.805,88.535; 38 51.805,87.265; 39 50.535,88.535; 40 50.535,87.265; 41 49.265,88.535; 42 49.265,87.265; 43 47.995,88.535; 44 47.995,87.265; 45 46.725,88.535; 46 46.725,87.265; 47 45.455,88.535; 48 45.455,87.265; 49 44.185,88.535; 50 44.185,87.265; 51 42.915,88.535; 52 42.915,87.265; 53 41.645,88.535; 54 41.645,87.265; 55 40.375,88.535; 56 40.375,87.265; 57 39.105,88.535; 58 39.105,87.265; 59 37.835,88.535; 60 37.835,87.265; 61 36.565,88.535; 62 36.565,87.265; 63 35.295,88.535; 64 35.295,87.265; 65 34.025,88.535; 66 34.025,87.265; 67 32.755,88.535; 68 32.755,87.265; 69 31.485,88.535; 70 31.485,87.265; 71 30.215,88.535; 72 30.215,87.265; 73 28.945,88.535; 74 28.945,87.265; 75 27.675,88.535; 76 27.675,87.265; 77 26.405,88.535; 78 26.405,87.265; 79 25.135,88.535; 80 25.135,87.265 | hole 3: 5.3,5.5; 94.5,5.5
SAMTEC_MCX-J-P-H-RA-TH1 = drill 1.1: 1 0,0 | drill 1.4: S1 -2.54,2.54; S2 2.54,2.54; S3 2.54,-2.54; S4 -2.54,-2.54
INDC2012X105N = smd 1.2 x 1.47: 1 -0.86,0; 2 0.86,0
R_8_ADI-L = smd 1.676 x 0.508: 1 -2.413,1.905; 2 -2.413,0.635; 3 -2.413,-0.635; 4 -2.413,-1.905; 5 2.413,-1.905; 6 2.413,-0.635; 7 2.413,0.635; 8 2.413,1.905
LINEAR_TECHNOLOGY_LTC1477CS8_2 = smd 2.5 x 0.7: 1 -2.45,1.905; 2 -2.45,0.635; 3 -2.45,-0.635; 4 -2.45,-1.905; 5 2.45,-1.905; 6 2.45,-0.635; 7 2.45,0.635; 8 2.45,1.905
RFM23BP = smd 4.5 x 1.3: 1 -14.55,7; 2 -14.55,5; 3 -14.55,3; 4 -14.55,1; 5 -14.55,-1; 6 -14.55,-3; 7 -14.55,-5; 8 -14.55,-7; 9 15.55,-7; 10 15.55,-5; 11 15.55,-3; 12 15.55,-1; 13 15.55,1; 14 15.55,3; 15 15.55,5; 16 15.55,7
RFM69HCW = smd 3.8 x 1.2: 1 1.8,15.55; 2 1.8,13.55; 3 1.8,11.55; 4 1.8,9.55; 5 1.8,7.55; 6 1.8,5.55; 7 1.8,3.55; 8 1.8,1.55; 9 15.5,1.55; 10 15.5,3.55; 11 15.5,5.55; 12 15.5,7.55; 13 15.5,9.55; 14 15.5,11.55; 15 15.5,13.55; 16 15.5,15.55
1X06_ROUND_70 = drill 1 pad 1.778: 1 -6.35,0; 2 -3.81,0; 3 -1.27,0; 4 1.27,0; 5 3.81,0; 6 6.35,0
ORION_A38L = smd 0.7 x 0.36: 1 -4.84,4; 2 -4.84,3.2; 3 -4.84,2.4; 4 -4.84,1.6; 5 -4.84,0.8; 6 -4.84,0; 7 -4.84,-0.8; 8 -4.84,-1.6; 9 -4.84,-2.4; 10 -4.84,-3.2; 11 -4.84,-4; 23 4.84,-4; 24 4.84,-3.2; 25 4.84,-2.4; 26 4.84,-1.6; 27 4.84,-0.8; 28 4.84,0; 29 4.84,0.8; 30 4.84,1.6; 31 4.84,2.4; 32 4.84,3.2; 33 4.84,4 | smd 0.36 x 0.7: 12 -4,-4.84; 13 -3.2,-4.84; 14 -2.4,-4.84; 15 -1.6,-4.84; 16 -0.8,-4.84; 17 0,-4.84; 18 0.81,-4.84; 19 1.6,-4.84; 20 2.4,-4.84; 21 3.2,-4.84; 22 4,-4.84; 34 4,4.84; 35 3.2,4.84; 36 2.4,4.84; 37 1.6,4.84; 38 0.8,4.84; 39 0,4.84; 40 -0.8,4.84; 41 -1.6,4.84; 42 -2.4,4.84; 43 -3.18,4.84; 44 -4,4.84 | smd 0.6 x 0.6: 45 -3,3; 46 -3,1.5; 47 -3,0; 48 -3,-1.5; 49 -3,-3; 50 -1.5,3; 51 -1.5,1.5; 52 -1.5,0; 53 -1.5,-1.5; 54 -1.5,-3; 55 0,3; 56 0,1.5; 57 0,0; 58 0,-1.5; 59 0,-3; 60 1.5,3; 61 1.5,1.5; 62 1.5,0; 63 1.5,-1.5; 64 1.5,-3; 65 3,3; 66 3,1.5; 67 3,0; 68 3,-1.5; 69 3,-3
TEENSY41 = drill 1: 0-RX1/CS1/CRX2 -27.94,-7.62; 1-TX1/MISO1/CTX2 -25.4,-7.62; 2-OUT2 -22.86,-7.62; 3-LRCLK2 -20.32,-7.62; 4-BCLK2 -17.78,-7.62; 5-IN2 -15.24,-7.62; 6-OUT1D -12.7,-7.62; 7-RX2/OUT1A -10.16,-7.62; 8-TX2/IN1 -7.62,-7.62; 9-OUT1C -5.08,-7.62; 10-CS\MQSR -2.54,-7.62; 11-MOSI/CTX1 0,-7.62; 12-MISO/MQSL 2.54,-7.62; 13-SCK/LED 2.54,7.62; 14-A0/TX3/SPDIF_OUT 0,7.62; 15-A1/RX3/SPDIF_IN -2.54,7.62; 16-A2/RX4/SCL1 -5.08,7.62; 17-A3/TX4/SDA1 -7.62,7.62; 18-A4/SDA0 -10.16,7.62; 19-A5/SCL0 -12.7,7.62; 20-A6/TX5/LRCLK1 -15.24,7.62; 21-A7/RX5/BCLK1 -17.78,7.62; 22-A8/CTX1 -20.32,7.62; 23-A9/CRX1/MCLK1 -22.86,7.62; 24-A10/TX6/SCL2 7.62,-7.62; 25-A11/RX6/SDA2 10.16,-7.62; 26-A12/MOSI1 12.7,-7.62; 27-A13/SCK1 15.24,-7.62; 28-RX7 17.78,-7.62; 29-TX7 20.32,-7.62; 30-CRX3 22.86,-7.62; 31-CTX3 25.4,-7.62; 32-OUT1B 27.94,-7.62; 33-MCLK2 27.94,7.62; 34-RX8 25.4,7.62; 35-TX8 22.86,7.62; 36-PWM 20.32,7.62; 37-PWM 17.78,7.62; 38-A14/CS/IN1 15.24,7.62; 39-A15/CS/OUT1A 12.7,7.62; 40-A16/CS1 10.16,7.62; 41-A17/MISO1 7.62,7.62; +5V -24.13,-4.62; D+ -30.25,-3.81; D- -30.25,-1.27; DM -21.59,-4.62; DP -19.05,-4.62; GND -30.25,1.27; GND4 -16.51,-4.62; GND5 -13.97,-4.62; ON/OFF 15.24,5.08; PROGRAM 15.24,2.54; VBAT 15.24,-5.08; VUSB -30.25,3.81 | drill 1 octagon: 3V3-1 5.08,-7.62; 3V3-2 15.24,-2.54; 3V3-3 -25.4,7.62 | drill 0.6: G -15.51,3.08; LED -17.51,3.08; R+ -17.51,5.08; R- -15.51,5.08; T+ -15.51,1.08; T- -17.51,1.08 | drill 1 square: GND1 -30.48,-7.62; GND2 15.24,0; GND3 5.08,7.62; GND6 -27.94,7.62 | drill 1 pad 1.676: VIN -30.48,7.62
ADAFRUIT_C25582-40G-M36-0A_0 = smd 1.02 x 1.524: 1 -24.13,-3.354; 2 -24.13,3.354; 3 -21.59,-3.354; 4 -21.59,3.354; 5 -19.05,-3.354; 6 -19.05,3.354; 7 -16.51,-3.354; 8 -16.51,3.354; 9 -13.97,-3.354; 10 -13.97,3.354; 11 -11.43,-3.354; 12 -11.43,3.354; 13 -8.89,-3.354; 14 -8.89,3.354; 15 -6.35,-3.354; 16 -6.35,3.354; 17 -3.81,-3.354; 18 -3.81,3.354; 19 -1.27,-3.354; 20 -1.27,3.354; 21 1.27,-3.354; 22 1.27,3.354; 23 3.81,-3.354; 24 3.81,3.354; 25 6.35,-3.354; 26 6.35,3.354; 27 8.89,-3.354; 28 8.89,3.354; 29 11.43,-3.354; 30 11.43,3.354; 31 13.97,-3.354; 32 13.97,3.354; 33 16.51,-3.354; 34 16.51,3.354; 35 19.05,-3.354; 36 19.05,3.354; 37 21.59,-3.354; 38 21.59,3.354; 39 24.13,-3.354; 40 24.13,3.354
SSW-120-02-G-D = drill 1.25 pad 1.4 octagon: 1 -24.13,-1.27; 2 -24.13,1.27; 3 -21.59,-1.27; 4 -21.59,1.27; 5 -19.05,-1.27; 6 -19.05,1.27; 7 -16.51,-1.27; 8 -16.51,1.27; 9 -13.97,-1.27; 10 -13.97,1.27; 11 -11.43,-1.27; 12 -11.43,1.27; 13 -8.89,-1.27; 14 -8.89,1.27; 15 -6.35,-1.27; 16 -6.35,1.27; 17 -3.81,-1.27; 18 -3.81,1.27; 19 -1.27,-1.27; 20 -1.27,1.27; 21 1.27,-1.27; 22 1.27,1.27; 23 3.81,-1.27; 24 3.81,1.27; 25 6.35,-1.27; 26 6.35,1.27; 27 8.89,-1.27; 28 8.89,1.27; 29 11.43,-1.27; 30 11.43,1.27; 31 13.97,-1.27; 32 13.97,1.27; 33 16.51,-1.27; 34 16.51,1.27; 35 19.05,-1.27; 36 19.05,1.27; 37 21.59,-1.27; 38 21.59,1.27; 39 24.13,-1.27; 40 24.13,1.27

### Placement (x,y rotation side)
C1  61.7,46.44 90 bottom
C2  58.72,46.42 270 bottom
C3  55.85,46.44 270 bottom
D1  17.46,21.08 180 bottom
D2  51.09,59.49 270 top
H1  0,0 0 top
J1  85.22,60.65 270 top
J9  37.06,51.98 90 top
L2  31.41,12.31 90 bottom
R1  68.87,46.36 270 bottom
R2  66.04,46.36 90 bottom
R3  33.63,23.55 90 bottom
R4  11.5,24.34 0 top
R5  11.45,27.24 180 top
R6  28.14,12.31 270 bottom
U1  69.09,55.82 0 bottom
U2  56.04,56.4 180 bottom
U3  54.36,18.87 0 bottom
U4  54.06,10.36 0 bottom
U5  23.01,45.63 0 top
U6  25.8,22.06 180 bottom
U$1  49.68,74.5 0 top
X1  46.45,35.23 0 top
X2  46.45,35.23 0 top

### Tracks (layer width: path | path; a pad name or v marks a point on that pad's centre or on a via)
3V3_BUS  (via drill 0.35)
  Top 0.5: v19.08,27.9 18.42,27.24 R5.1
  Route15 0.5: 15.41,89.84 16.62,89.84 16.63,89.83 48.95,89.83
  Route15 0.8: v19.08,27.9 9.22,37.76 9.22,83.65 15.41,89.84
  Bottom 0.5: v19.08,27.9 25.95,27.9 26.61,27.24 U6.18
5V_BUS  (via drill 0.35)  (1 unrouted)
  Route2 0.7: U$1.+5V 25.55,66.14 26.94,64.75 43.57,64.75
  Route2 0.8: v49.06,55.58 49.06,59.26 43.57,64.75
  Bottom 0.4: 15.78,91.67 15.43,91.32 15.37,91.32
  Bottom 0.7: 15.37,91.32 14.28,90.23 14.28,85.36 17.52,82.12 U$1.VIN
  Bottom 0.8: U2.2 U2.3 | U2.3 U2.6 U2.7 | C3.1 53.96,47.34 50.67,50.63 50.67,54.11 U2.3 | U2.3 50.51,57.03 v49.06,55.58
+3V3_VCC  (via drill 0.35)  (2 unrouted)
  Top 0.3: 56.66,39.73 56.59,39.66 56.59,30.88
  Top 0.6: U5.2 9.03,35.46 9.03,19.47 11.83,16.67 v17.77,16.67 17.82,16.72 39.45,16.72 v43.8,12.37 | v62.67,43.3 60.23,43.3 56.66,39.73 | v48.31,28.41 54.12,28.41 56.59,30.88
  Route2 0.8: v48.31,28.41 48.31,16.88 v43.8,12.37
  Route15 0.75: U$1.3V3-1 54.76,53.59 62.67,45.68 v62.67,43.3
  Bottom 0.4: U6.58 25.06,22.82 22.53,22.82 22.01,22.3 22.01,19.52 21.35,18.86 U6.2
  Bottom 0.5: v43.8,12.37 41,9.57 33.29,9.57 L2.1 | U6.2 19.97,18.87 v17.77,16.67 | 38.77,19.91 U3.13 38.7,19.77 U4.13
  Bottom 0.6: C1.1 61.7,44.27 v62.67,43.3
  Bottom 0.8: U1.8 64.9,57.72 64.22,57.04 64.22,54.48 | U1.5 64.79,53.91 64.22,54.48 | 64.22,54.48 64.22,47.13 62.63,45.54 C1.1 | 82.98,19.7 74.27,28.41 v48.31,28.41 | L2.1 32.51,11.45 34.13,13.07 34.13,18.25 35.79,19.91 38.77,19.91
AIN0  (via drill 0.35)
  Route15 0.4: U$1.14-A0/TX3/SPDIF_OUT 51.66,84.1 69.9,84.1 71.27,82.73 71.27,79.95 76.39,74.83 76.39,55.57 v74.76,53.94
  Bottom 0.5: R1.1 74.76,53.15 v74.76,53.94
  Bottom 0.8: R1.1 R2.2
AIN1
  Route2 0.5: U$1.15-A1/RX3/SPDIF_IN 44.71,84.55 21.11,84.55
AIN2
  Route2 0.4: 48.86,85.14 48.86,86.86 48.45,87.27 20.89,87.27 | 49.84,84.16 50,84 55.42,84
  Route2 0.5: 55.42,84 U$1.41-A17/MISO1 | 48.86,85.14 49.84,84.16
AIN3
  Route15 0.5: 23.47,84.73 31.83,84.73 U$1.20-A6/TX5/LRCLK1
AIN4
  Route15 0.5: 20.94,87.22 20.94,85 22.33,83.61 30.41,83.61 U$1.21-A7/RX5/BCLK1
AIN5
  Top 0.5: 26.82,83.92 27.83,83.92 29.36,82.39 U$1.22-A8/CTX1
AIN6
  Top 0.45: 23.48,87.23 23.48,84.89
  Top 0.5: 23.48,84.89 23.48,84.78 U$1.23-A9/CRX1/MCLK1
ANT_CONN  (via drill 0.35)
  Route15 0.8: J1.1 85.86,60.01 85.86,33.36 62.67,10.17 35.72,10.17 v34.52,11.37
  Bottom 0.5: v34.52,11.37 35.02,11.87 U3.9 41.97,11.87 U4.9
DIO1  (via drill 0.35)
  Route15 0.5: v36.3,61.35 36.53,61.35 U$1.8-TX2/IN1
  Bottom 0.3: 41.4,37.84 41.4,32.55 41.44,32.51
  Bottom 0.6: U3.15 38.66,23.87 | U4.15 38.6,23.87 U3.15 | U3.15 41.33,23.87 42.19,24.73 42.19,31.76 41.44,32.51 | v36.3,61.35 42.42,55.23 42.42,38.86 41.4,37.84
ETH_RX+  (via drill 0.35)
  Top 0.6: 79.28,14.68 78.28,15.68 43.8,15.68 v42.42,17.06
  Route15 0.3: 28.71,32.72 28.67,32.76 28.67,37.42
  Route15 0.4: v42.42,17.06 41.65,17.06 28.71,30 28.71,32.72 | 23.04,68.06 23.04,50.68 25.59,48.13 25.59,44.31 28.67,41.23 28.67,37.42
  Route15 0.5: U$1.R+ 23.04,70.45 23.04,68.06
ETH_RX-  (via drill 0.35)
  Top 0.6: 80.2,15.68 79.28,16.6 45.28,16.6 45.28,16.63 v42.55,19.36
  Route15 0.3: 33.75,37.37 33.75,32.73 33.7,32.68
  Route15 0.4: v42.55,19.36 33.7,28.21 33.7,32.68 | 33.75,37.37 33.75,41.07 31.07,43.75 31.07,53.29 25.63,58.73 25.63,67.95 | U$1.R- 33.19,78.6 33.19,77.07 32.78,76.66 31.61,76.66 26.85,71.9
  Route15 0.5: 25.63,67.95 26.85,69.17 26.85,71.9
ETH_TX+  (via drill 0.35)
  Top 0.6: 47,18.68 v37.16,28.52
  Route15 0.3: 38.86,37.35 38.86,32.75 38.79,32.68
  Route15 0.4: v37.16,28.52 38.79,30.15 38.79,32.68 | 38.86,43.99 41.29,46.42 41.29,55.07 33.11,63.25 33.09,63.27
  Route15 0.5: 38.86,43.99 38.86,37.35 | 33.11,63.25 33.11,67.75 31.99,68.87 31.99,73.4 U$1.T+
ETH_TX-  (via drill 0.35)
  Top 0.6: 45.52,17.68 v35.47,27.73
  Route15 0.3: 36.37,33.1 36.37,33.4 36.32,33.45 36.32,37.49 36.27,37.54
  Route15 0.4: v35.47,27.73 36.37,28.63 36.37,33.1 | 36.27,37.54 36.27,50.5 28.03,58.74 28.03,67.57
  Route15 0.5: 28.03,67.57 29.28,68.82 29.28,72.69 U$1.T-
GND  (via drill 0.35)
  other vias: 13.32,4.42 15.35,4.42 16.37,4.42 17.38,4.42 18.4,4.42 19.42,4.42 20.43,4.42 14.34,4.42 29.58,4.42 30.59,4.42 31.61,4.42 32.62,4.42 33.64,4.42 34.66,4.42 35.67,4.42 36.69,4.42 7.33,82.42 7.33,84.46 7.33,85.47 7.33,86.49 7.33,87.5 7.33,88.52 7.33,89.54 7.33,83.44 7.33,66.22 7.33,68.25 7.33,69.27 7.33,70.28 7.33,71.3 7.33,72.32 7.33,73.33 7.33,67.24 61.45,4.42 63.48,4.42 64.5,4.42 65.52,4.42 66.53,4.42 67.55,4.42 68.56,4.42 62.47,4.42 77.71,4.42 78.72,4.42 79.74,4.42 80.76,4.42 81.77,4.42 82.79,4.42 83.81,4.42 84.82,4.42 91.68,12.19 91.68,14.23 91.68,15.24 91.68,16.26 91.68,17.27 91.68,18.29 91.68,13.21 91.78,77.9 91.78,79.94 91.78,80.95 91.78,81.97 91.78,82.98 91.78,84 91.78,85.02 91.78,78.92 82.96,88.17
  pour Top: -1,-1 -1,95.6 100.8,95.6 100.8,-1
  pour Route2: -2,-2 -2,96.6 101.8,96.6 101.8,-2
  pour Route15: -3,-3 -3,97.6 102.8,97.6 102.8,-3
  pour Bottom: -4,-4 -4,98.6 103.8,98.6 103.8,-4
GND1  (via drill 0.35)  (7 unrouted)
  other vias: 91.82,30.26 91.82,32.3 91.82,33.31 91.82,34.33 91.82,35.34 91.82,36.36 91.82,37.38 91.82,31.28
GND2  (via drill 0.35)  (7 unrouted)
  other vias: 91.71,61.85 91.71,63.89 91.71,64.9 91.71,65.92 91.71,66.93 91.71,67.95 91.71,68.97 91.71,62.87
GND3  (via drill 0.35)  (7 unrouted)
  other vias: 91.68,46.23 91.68,48.27 91.68,49.28 91.68,50.3 91.68,51.31 91.68,52.33 91.68,53.35 91.68,47.25
GPIO17
  Top 0.5: X1.11 45.96,20.94 75.37,20.94 82.5,28.07 82.51,28.07
GPIO22
  Top 0.5: X1.15 40.1,30.24 47.15,23.19 75.13,23.19 83.39,31.45
GPIO23
  Top 0.3: 41.37,32.18 41.37,37.31 X1.16
  Top 0.5: 83.1,32.45 74.98,24.33 47.37,24.33 41.37,30.33 41.37,32.18
GPIO24  (via drill 0.35)
  Top 0.5: 82.93,33.45 81.65,32.17 81.63,32.17 v81.35,31.89 | v48.41,45.68 42.64,39.91 X1.18
  Route15 0.5: v81.35,31.89 80.89,31.89 79.99,32.79 79.99,36.12 76.17,39.94 54.17,39.94 48.43,45.68 v48.41,45.68
GPIO25  (via drill 0.35)
  Top 0.5: v81.29,33.08 82.66,34.45 | v52.32,44.49 47.72,39.89 X1.22
  Route15 0.5: v81.29,33.08 81.29,36.44 76.55,41.18 55.63,41.18 v52.32,44.49
GPIO27
  Top 0.5: X1.13 37.56,31.13 46.4,22.29 75.3,22.29 83.46,30.45
GPS_RSTN  (via drill 0.35)
  Route2 0.5: U$1.33-MCLK2 89.58,70.16 89.58,65.8
  Route2 0.6: v19.73,15.39 26.95,8.17 82.05,8.17 89.58,15.7 89.58,65.8
  Bottom 0.5: U6.1 19.73,16.83 v19.73,15.39
I2C1_SCL
  Bottom 0.4: 84.85,52.42 85.3,52.87 85.3,57.63 80.26,62.67 80.26,66.11 75.79,70.58 61,70.58 U$1.24-A10/TX6/SCL2 57.3,74.69 63.49,80.88 63.49,83.15 64.34,84 68.48,84
I2C1_SDA
  Route2 0.5: U$1.25-A11/RX6/SDA2 59.84,77.1 63.54,80.8 63.54,82.92 64.87,84.25 66.19,84.25
  Bottom 0.4: U$1.25-A11/RX6/SDA2 61.15,68.19 67.84,68.19 68.75,67.28 68.75,65.49 | 68.75,65.49 68.75,65.45 | 68.75,65.49 80.82,53.42
I2C2_SCL
  Top 0.45: U5.4 24.28,54.39 35.71,65.82 35.71,67.78 37.91,69.98 37.91,81.19 U$1.19-A5/SCL0
I2C2_SDA
  Top 0.45: U$1.18-A4/SDA0 39.52,69.76 38.29,68.53 38.29,66.22 26.82,54.75 U5.5
N$1  (via drill 2.5 pad 3.5)
  other vias: 33.47,58.33
N$2  (via drill 2.8 pad 6)
  other vias: 17.42,35.24
N$3  (via drill 2.5 pad 3.5)
  other vias: 12.85,45.63
N$4  (via drill 2.5 pad 3.5)
  other vias: 12.85,58.33
N$5  (via drill 2.8 pad 6)
  other vias: 75.42,35.23
N$6  (via drill 2.8 pad 6)
  other vias: 75.42,12.23
N$7  (via drill 2.8 pad 6)
  other vias: 17.42,12.23
N$8  (via drill 0.35)
  Top 0.4: D2.A 49.25,60.58 v49.25,62.15
  Route2 0.4: v49.25,62.15 48.34,63.06 48.34,68 39.74,76.6 33.15,76.6 U$1.LED
N$9
  Bottom 0.5: U3.14 34.41,21.87 R3.1
N$14  (via drill 2.5 pad 3.5)
  other vias: 33.47,45.63
N$15
  Bottom 0.8: R1.2 71.83,45.46 76.13,49.76 76.13,55.77 74.18,57.72 U1.1
N$16  (via drill 0.35)
  Top 0.5: R5.2 12.4,25.4 R4.2 12.51,24.45 v17.73,24.45
  Bottom 0.5: v17.73,24.45 v17.74,24.46 U6.9
N$17
  Bottom 0.3: 38.73,38.06 38.85,38.18 38.85,30.37
  Bottom 0.4: L2.2 32.34,14.1 32.34,17.9 31.81,18.43 31.38,18.86 U6.32
  Bottom 0.5: J9.1 37.06,39.73 38.73,38.06 | 31.81,18.43 31.81,26.32 35.22,29.73 38.21,29.73 38.85,30.37
N$21
  Bottom 0.5: U6.7 18.48,22.86 D1.A
PI_STATUS
  Top 0.5: X1.8 29.94,40.1 31.06,41.22 37.51,41.22 51.72,55.43 87.91,55.43 89.53,57.05 89.53,64.18 86.83,66.88 U$1.32-OUT1B
RADIO_RESET  (via drill 0.35)
  Route2 0.6: v44.92,28.65 42.6,26.33 v33.67,26.33
  Bottom 0.3: 43.86,37.49 43.88,37.47 43.88,33.07
  Bottom 0.4: U$1.7-RX2/OUT1A 39.52,60.88 43.8,56.6
  Bottom 0.5: 43.86,37.49 43.8,37.55 43.8,56.6
  Bottom 0.6: U4.6 49.69,15.91 49.63,15.9 43.82,21.71 43.82,29.63 43.88,29.69 | v33.67,26.33 33.67,24.49 R3.2 | 43.88,33.07 43.88,29.69 | 43.88,29.69 v44.92,28.65
RF_GND
  Bottom 0.4: U6.21 U6.22 29.8,25.66 30.2,25.26 U6.24 U6.25 30.13,24.46 29.75,24.08 29.75,23.35 30.24,22.86 U6.27 U6.28 U6.29 30.32,21.26 29.87,20.81 29.87,19.99 30.2,19.66 U6.31 30.31,19.66 29.77,19.12 29.77,18.4 30.11,18.06 U6.33 30.64,16.56 28.3,14.22 28.3,13.21
  Bottom 0.5: 28.3,13.21 R6.1
RPI_5V_PWR_IN  (via drill 0.35)
  Top 0.8: v22.3,42.36 22.3,38.6 X1.2
  Route2 0.8: v54.25,52.24 54.25,48.85 47.76,42.36 v22.3,42.36
  Bottom 0.6: U2.1 53.59,52.9 v54.25,52.24
  Bottom 0.8: U2.1 U2.8 58.49,47.55 C2.1
RPI_ENABLE  (via drill 0.35)
  Top 0.45: U$1.36-PWM 70,72.41 66.33,68.74 66.33,66.1 65.35,65.12 61.84,65.12 v58.58,61.86
  Bottom 0.8: U2.4 57.15,61.86 v58.58,61.86
SCL1_I2C  (via drill 0.35)
  Top 0.3: X1.5 28.67,33.15 28.67,40.55
  Top 0.45: U$1.16-A2/RX4/SCL1 43.28,80.8 43.28,64.52 41.54,62.78 41.54,61.19 46.88,55.85 46.88,52.6
  Top 0.5: 28.67,40.55 30.41,42.29 36.57,42.29 46.88,52.6
  Top 0.6: X1.5 27.4,31 v14.5,18.1
  Bottom 0.5: 13.91,16.22 14.5,16.81 v14.5,18.1
SDA1_I2C  (via drill 0.35)
  Top 0.3: X1.3 26.11,33.13 26.11,39.63
  Top 0.45: U$1.17-A3/TX4/SDA1 40.69,80.75 40.69,63.21 40.1,62.62 40.1,61.03 45.53,55.6 45.53,52.96
  Top 0.5: 26.11,39.63 29.66,43.18 35.75,43.18 45.53,52.96
  Top 0.6: X1.3 24.86,29.91 v14.46,19.51
  Bottom 0.5: v14.46,19.51 13.1,18.15
SPI0_CE0_N
  Top 0.5: 57.16,45.48 X1.24
SPI0_CE1_N
  Top 0.5: 58.7,44.48 X1.26
SPI0_MISO  (via drill 0.35)
  Top 0.3: X1.21 46.47,33.13 46.47,39.83
  Top 0.5: 46.47,39.83 55.12,48.48
  Top 0.6: X1.21 v47.72,29.64 v47.71,29.63
  Route15 0.3: v47.71,29.63 47.41,29.63 43.88,33.16 43.88,37.63
  Route15 0.5: U$1.12-MISO/MQSL 52.14,66.88 43.88,58.62 43.88,37.63
SPI0_MOSI  (via drill 0.35)
  Top 0.3: 43.88,39.86 43.88,33.18 X1.19
  Top 0.5: 53.5,49.48 43.88,39.86
  Top 0.6: X1.19 45.18,30.17 v45.78,29.57
  Route15 0.3: v45.78,29.57 45.04,29.57 41.35,33.26 41.35,37.6 41.38,37.63
  Route15 0.5: 41.38,37.63 41.38,43.69 42.42,44.73 42.42,59.62 U$1.11-MOSI/CTX1
SPI0_SCLK  (via drill 0.35)
  Top 0.3: 48.95,39.94 48.95,37.02 48.96,37.01 48.96,33.18 X1.23
  Top 0.5: 56.49,47.48 48.95,39.94
  Top 0.6: X1.23 50.26,30.31 v49.63,29.68
  Route15 0.3: v49.63,29.68 49.63,29.88 46.45,33.06 46.45,37.55
  Route15 0.5: 46.45,37.55 45.09,38.91 45.09,56.35 53.38,64.64 53.38,76.99 52.22,78.15 U$1.13-SCK/LED
SPI1_CS1  (via drill 0.35)
  Route2 0.5: v80.17,19.69 84.38,23.9 84.38,51.19 79.26,56.31 79.26,65.03 82.83,68.6 82.83,70.11 80.71,72.23 74.81,72.23 U$1.38-A14/CS/IN1
  Bottom 0.6: v80.17,19.69 78.35,17.87 U3.5 68.87,17.91 U4.5
SPI1_D0  (via drill 0.35)
  Route2 0.5: v78.62,21.2 80.12,22.7 80.12,50.79 71,59.91 58.85,59.91 56.13,62.63 56.13,75.87 U$1.39-A15/CS/OUT1A
  Bottom 0.3: 36.21,85.22 36.17,85.26 36.17,91.62 35.5,92.29 32.46,92.29 18.41,92.29
  Bottom 0.5: 36.21,85.22 37.23,84.19 60.3,84.19 U$1.39-A15/CS/OUT1A
  Bottom 0.6: v78.62,21.2 75.95,23.87 U3.2 68.87,23.91 U4.2
SPI1_D1  (via drill 0.35)
  Route2 0.5: v77.44,20.03 78.7,20.03 83.17,24.5 83.17,50.3 71.01,62.46 61.74,62.46 60.82,63.38 60.82,65.32 U$1.26-A12/MOSI1
  Bottom 0.3: 20.89,89.82 33.11,89.82 33.67,89.26 33.67,85.16
  Bottom 0.5: U$1.26-A12/MOSI1 60.84,65.34 49.29,65.34 48.32,66.31 48.32,68.49 35.67,81.14 35.67,83.16 33.67,85.16
  Bottom 0.6: v77.44,20.03 75.6,21.87 U3.3 68.87,21.91 U4.3
SPI1_SCLK  (via drill 0.35)
  Top 0.5: v62.58,63.64 62.58,59.33 v63.44,58.47
  Route2 0.4: U$1.27-A13/SCK1 64.92,65.98 v62.58,63.64
  Route2 0.5: v75.53,20.04 78.84,23.35 78.84,48.17 68.54,58.47 v63.44,58.47
  Bottom 0.3: 18.47,89.69 18.47,87.63 18.87,87.23 30.68,87.23 31.12,86.79 31.12,85.1
  Bottom 0.4: 33.14,81.32 33.69,80.77 34.66,80.77
  Bottom 0.5: U$1.27-A13/SCK1 62.47,64.43 46.61,64.43 45.79,65.25 45.79,69.64 34.66,80.77 | 31.12,85.1 33.14,83.08 33.14,81.32
  Bottom 0.6: v75.53,20.04 75.36,19.87 U3.4 68.87,19.91 U4.4
T_CS  (via drill 0.35)
  Top 0.45: v42.68,62.22 44.62,62.22 47.14,64.74 U$1.10-CS\MQSR
  Route2 0.4: 17.92,52.96 17.92,42.83
  Route2 0.5: v42.68,62.22 27.18,62.22 17.92,52.96 | 17.92,42.83 v17.19,42.1
  Bottom 0.5: v17.19,42.1 17.19,42.01 13.95,38.77
T_CS1
  Top 0.3: 20.89,92.35 32.28,92.35 32.34,92.29 45.96,92.29 46.3,91.95 46.3,84.58 46.04,84.32
  Top 0.4: U$1.9-OUT1C 45.75,68.03 45.75,84.03 46.04,84.32
T_GPIO2
  Bottom 0.3: 17.99,46.71 17.99,46.34 17.99,44.42
  Bottom 0.5: 17.99,44.42 17.99,41.14 13.16,36.31 | U$1.2-OUT2 17.99,58.05 17.99,46.34
T_GPIO3
  Bottom 0.3: 20.55,46.82 20.55,46.47 20.55,44.48 20.52,44.45
  Bottom 0.4: 20.82,44.15 20.82,33.5 18.91,31.59
  Bottom 0.5: 20.52,44.45 20.82,44.15 | 14,30.42 15.17,31.59 18.91,31.59 | U$1.3-LRCLK2 20.55,58.07 20.55,46.47
T_GPIO4
  Bottom 0.3: 23.58,32.83 23.58,37.81 | 23.07,46.79 23.07,44.64 23.01,44.58
  Bottom 0.5: 23.58,37.81 23.58,44.01 23.01,44.58 | 23.1,46.82 23.07,46.79 23.07,58.05 U$1.4-BCLK2 | 15.31,29.42 16.68,30.79 21.54,30.79 23.58,32.83
T_GPIO5
  Bottom 0.3: 26.16,32.89 26.16,37.27 | 25.62,44.33 25.62,46.78
  Bottom 0.5: 25.62,44.33 26.16,43.79 26.16,37.27 | 26.16,32.89 23.24,29.97 17.19,29.97 15.64,28.42 | 25.62,46.78 25.62,58.06 U$1.5-IN2
T_GPIO6
  Bottom 0.3: 28.6,32.66 28.64,32.7 28.64,37.35 | 28.12,46.71 28.12,44.4 28.08,44.36
  Bottom 0.5: 28.64,37.35 28.64,43.8 28.08,44.36 | 16.15,27.42 17.72,28.99 24.93,28.99 28.6,32.66 | 28.12,46.71 28.12,58.02 U$1.6-OUT1D
T_PROGRAM
  Bottom 0.4: U$1.PROGRAM 72.29,77.04 81.22,68.11
T_VBAT  (via drill 0.35)
  Route2 0.5: U$1.VBAT 81.14,69.42 v81.33,69.61
  Bottom 0.8: v81.33,69.61 81.83,69.11
T_VUSB  (via drill 0.35)
  Route2 0.4: 50.88,63.73 50.88,68.57 40.86,78.59
  Route2 0.45: U$1.VUSB 28.77,78.31 29.05,78.59 40.86,78.59
  Route2 0.6: v75.56,39.05 50.88,63.73
  Bottom 0.6: 77.86,39.05 v75.56,39.05
UART2_RXD
  Bottom 0.5: 83.42,80.91 82.78,80.27 76.93,80.27 U$1.34-RX8
UART2_TXD
  Bottom 0.5: U$1.35-TX8 75.75,78.91
UART4_RXD
  Top 0.45: 16.34,88.5 11.56,83.72 11.56,75.72 18.28,69 19.62,69 U$1.0-RX1/CS1/CRX2
UART4_TXD
  Top 0.45: 17.13,81.65 18.5,80.28 19.96,80.28 22.38,77.86 22.38,68.78 U$1.1-TX1/MISO1/CTX2
UART5_RXD  (via drill 0.35)
  Top 0.45: U$1.29-TX7 70,64.94 77,57.94 80.3,57.94 v80.34,57.98
  Route2 0.5: v79.92,12.53 85.93,18.54 85.93,52.39 v80.34,57.98
  Bottom 0.5: 81.96,13.19 81.3,12.53 v79.92,12.53 | 36.49,8.64 28,8.64 23.4,13.24 U6.42
  Bottom 0.508: 36.49,8.64 77.41,8.64 81.96,13.19 81.96,17.74 82.92,18.7
UART5_TXD  (via drill 0.35)
  Top 0.45: v84.33,56.94 84.07,56.68 74.29,56.68 67.39,63.58 67.39,66.81 U$1.28-RX7
  Route2 0.5: v81.03,9.2 87.84,16.01 87.84,55.38 86.28,56.94 v84.33,56.94
  Bottom 0.5: v81.03,9.2 81.03,10.38 83.92,13.27 | U6.44 21.78,17.2 21.78,12.72 26.78,7.72
  Bottom 0.508: 83.92,13.27 78.37,7.72 26.78,7.72
USB_DEV_D+  (via drill 0.35)
  Route2 0.5: 10.64,33.99 10.64,64.44 U$1.D+
  Route2 0.6: v77.35,29.29 52.78,29.29 51.51,30.56 14.07,30.56 10.64,33.99
  Bottom 0.6: 78.07,30.01 v77.35,29.29
USB_DEV_D-  (via drill 0.35)
  Route2 0.45: U$1.D- 22.95,69.71 22.95,65.31 15.99,58.35 15.99,47.47
  Route2 0.6: v77.38,31.03 53.5,31.03 52.9,31.63 15.42,31.63 13.42,33.63 13.42,37.1 15.26,38.94 15.26,46.74 15.99,47.47
  Bottom 0.6: 77.4,31.01 v77.38,31.03
USB_HOST_D+
  Bottom 0.4: 47.22,60.95 47.22,61.83 43.36,65.69 43.36,68.06 40.18,71.24 31.45,71.24 30.63,70.42 U$1.DP
  Bottom 0.6: 82.71,45.34 79.26,41.89 56.68,41.89 47.22,51.35 47.22,60.95
USB_HOST_D-
  Bottom 0.4: U$1.DM 29.54,68.43 39.55,68.43 40.63,67.35 40.63,65.8 45.44,60.99 45.44,60.33
  Bottom 0.6: 45.44,60.33 45.44,49.96 54.73,40.67 80.4,40.67

### Text on the board
tPlace: Teensy 4.1 | Raspberry Pi Zero
tNames: Radio / Conn | Modular IMU | + | - | GPS / Conn | Ethernet / LED | RPi SPI | OBC Board Rev. 4.22 | RPi GPIO | J7 | Teensy / Ethernet
bNames: UART2 / Breakout | Teensy / Test | RPi / Enable | Temp. / Sensor | Teensy / I2C | Teensy / USB / Host | Teensy / CS | ORION GPS | Modular Radio | Teensy / USB Dev | + | Teensy / GPIO | - | Adafruit GPS / Breakout | RPi I2C